# Altium project UmTRXv21.PRJPCB (part 1 of 2)
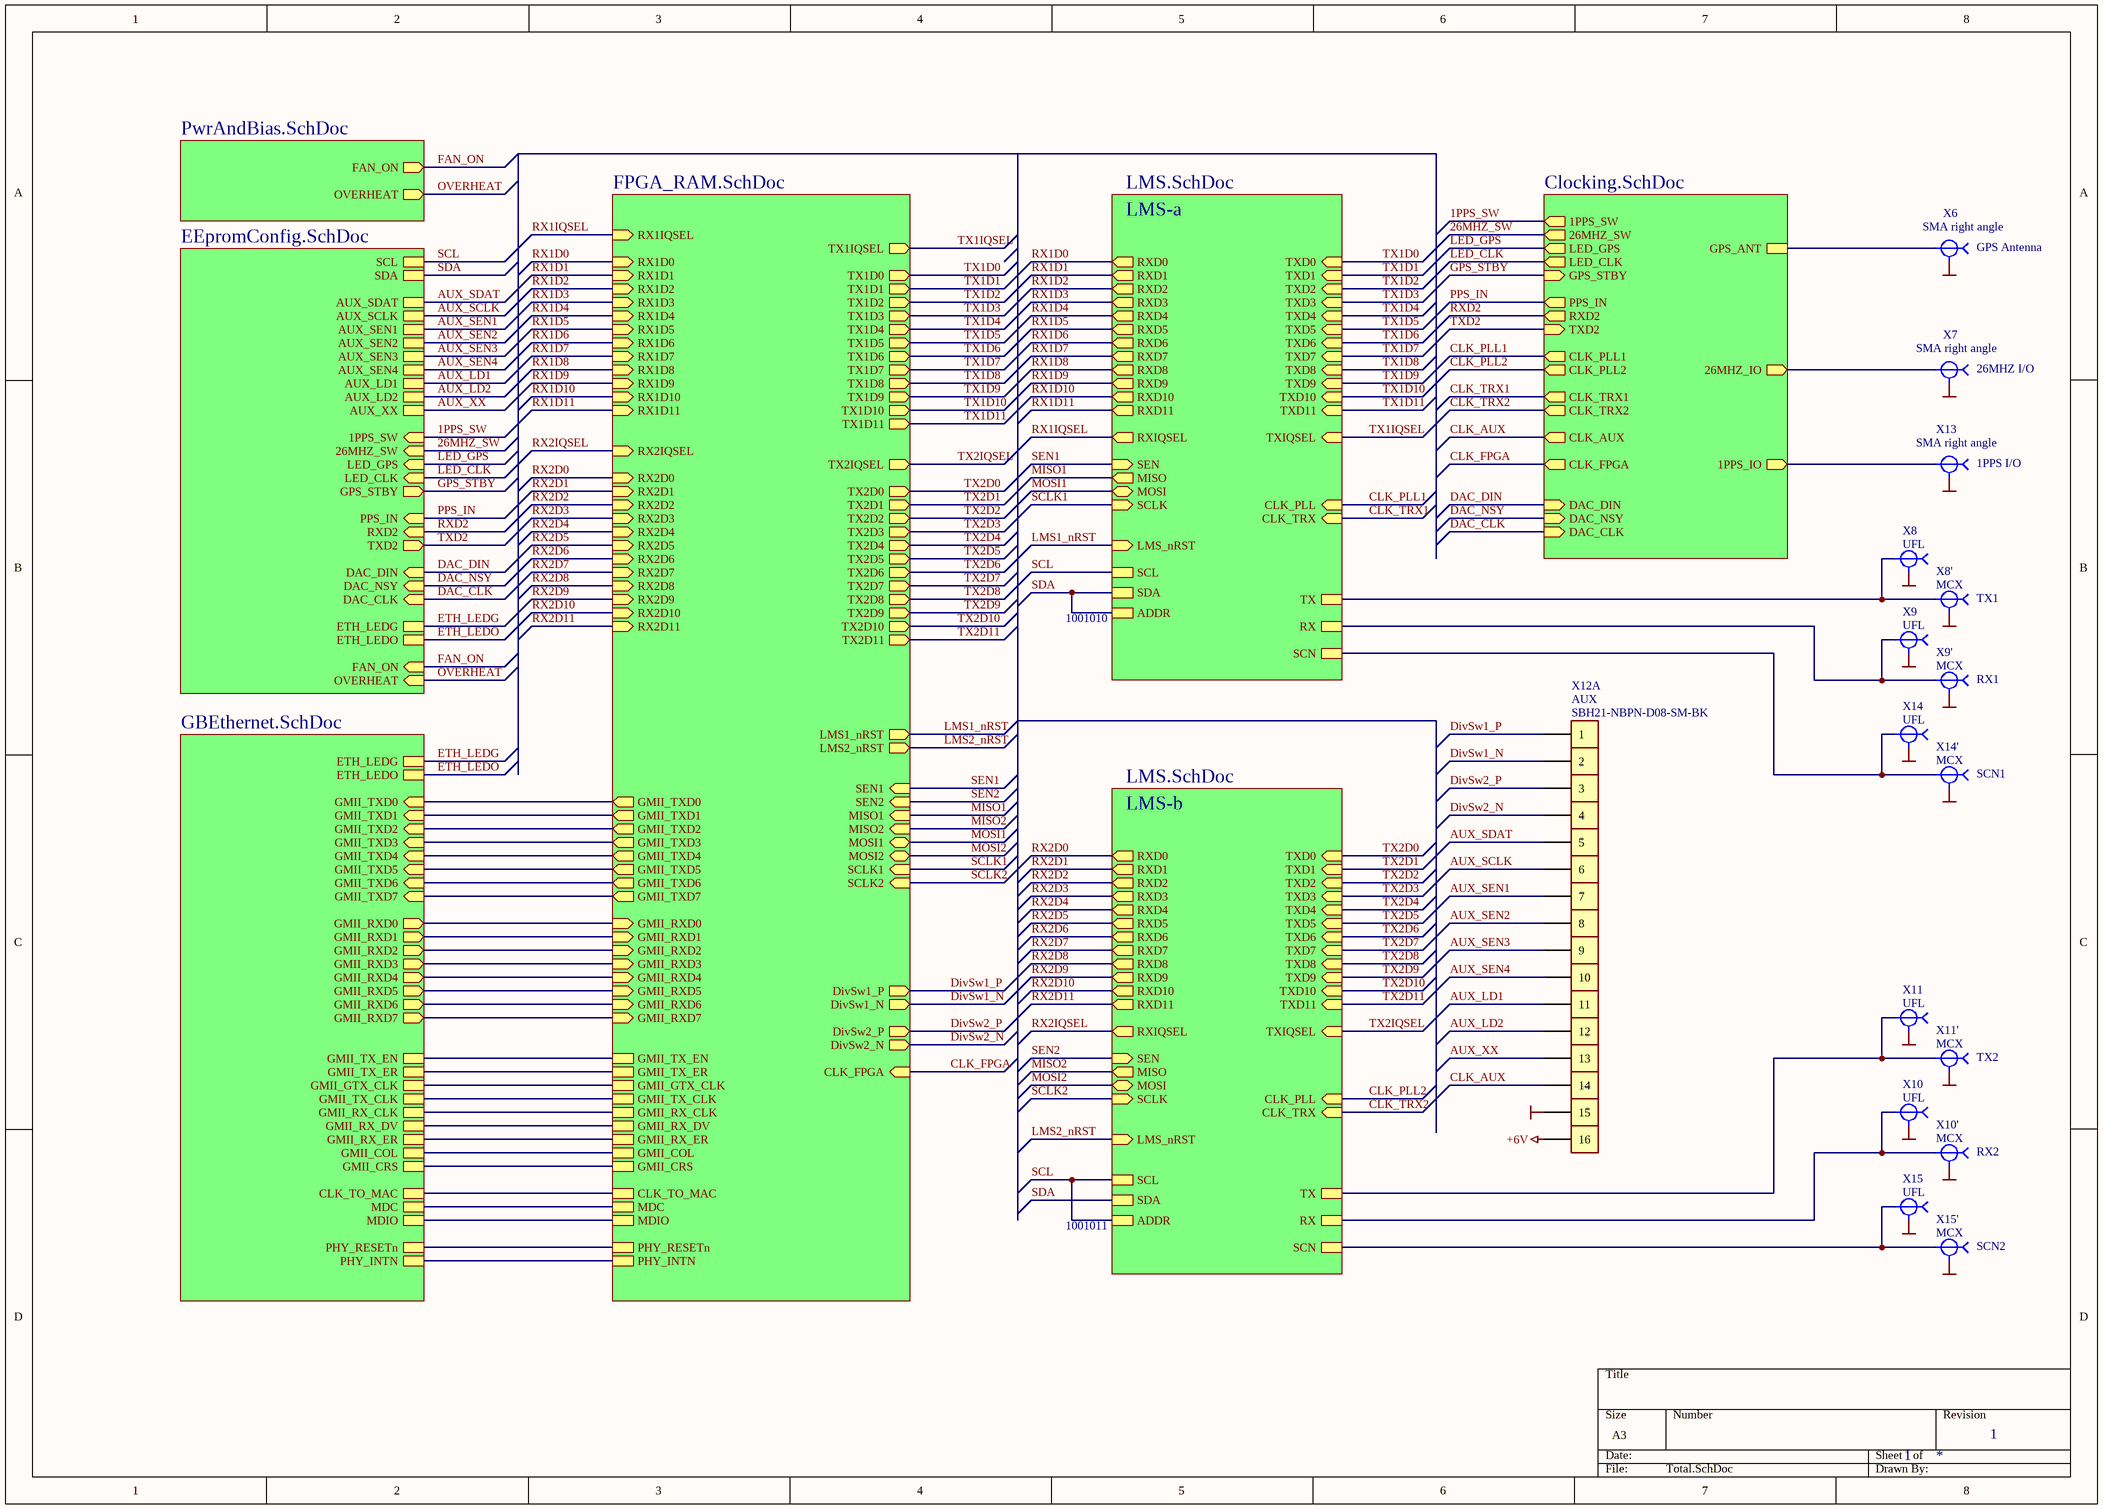
[diagram p0: Total.SchDoc]
5 sheets, 625 parts. Net scope: hierarchical (ports join the sheet entries above them; power ports are global).
Board file: UmTRXv21.PcbDoc
Sheets:
  Total.SchDoc
    PwrAndBias = PwrAndBias.SchDoc
    GBEthernet = GBEthernet.SchDoc
    EEpromConfig = EEpromConfig.SchDoc
    LMS-a = LMS.SchDoc
    LMS-b = LMS.SchDoc

## Sheet Total.SchDoc: USRP Cellular Tranceiver
size A3; Revision: 1; SheetNumber: 1; DocumentName: Fairwaves Co.

### Parts
X6  SMA right angle  Description: GPS Antenna  [SMA right angle]
X7  SMA right angle  Description: 26MHZ I/O  [SMA right angle]
X8  UFL  [U_FL]
X8'  MCX  Discription: TX1  [ML 120]
X9  UFL  [U_FL]
X9'  MCX  Discription: RX1  [ML 120]
X10  UFL  [U_FL]
X10'  MCX  Discription: RX2  [ML 120]
X11  UFL  [U_FL]
X11'  MCX  Discription: TX2  [ML 120]
X12  SBH21-NBPN-D08-SM-BK  Misc: AUX  [SBH-16]  (parts A,B,C,D,E,F,G,H,I,J,K,L,M,N,O,P of 16)
X13  SMA right angle  Description: 1PPS I/O  [SMA right angle]
X14  UFL  [U_FL]
X14'  MCX  Discription: SCN1  [ML 120]
X15  UFL  [U_FL]
X15'  MCX  Discription: SCN2  [ML 120]

### Sub-sheets
Clocking = Clocking.SchDoc (file not in this document): TXD2 (in), 26MHZ_IO (out), CLK_FPGA (out), CLK_TRX1 (out), GPS_ANT, DAC_DIN (in), DAC_NSY (in), DAC_CLK (in), PPS_IN (out), RXD2 (out), CLK_PLL1 (out), CLK_AUX (out), 1PPS_IO (out), CLK_PLL2 (out), CLK_TRX2 (out), 1PPS_SW (out), 26MHZ_SW (out), LED_GPS (out), LED_CLK (out), GPS_STBY (in)
EEpromConfig = EEpromConfig.SchDoc: PPS_IN (in), DAC_DIN (in), DAC_NSY (in), DAC_CLK (in), TXD2 (out), RXD2 (in), ETH_LEDG, ETH_LEDO, FAN_ON (in), OVERHEAT (in), AUX_SDAT, AUX_SCLK, AUX_SEN1, AUX_LD1, AUX_XX, AUX_SEN2, AUX_LD2, 1PPS_SW (in), 26MHZ_SW (in), LED_GPS (in), LED_CLK (in), AUX_SEN3, AUX_SEN4, GPS_STBY (out), SCL, SDA
FPGA_RAM = FPGA_RAM.SchDoc (file not in this document): DivSw1_P (out), DivSw1_N (out), TX1IQSEL (out), TX2IQSEL (out), RX1IQSEL (in), RX2IQSEL (in), SEN1 (in), SEN2 (in), MISO1 (in), MOSI1 (bidir), SCLK1 (in), DivSw2_P (out), DivSw2_N (out), CLK_FPGA (in), CLK_TO_MAC, GMII_TX_EN, GMII_TX_ER, GMII_GTX_CLK, GMII_TX_CLK, GMII_RX_CLK, GMII_RX_DV, GMII_RX_ER, GMII_COL, GMII_CRS, MDIO, MDC, PHY_INTN, PHY_RESETn, MISO2 (in), MOSI2 (bidir), SCLK2 (in), LMS1_nRST (out), LMS2_nRST (out), TX1D0 (out), TX1D1 (out), TX1D2 (out), TX1D3 (out), TX1D4 (out), TX1D5 (out), TX1D6 (out), TX1D7 (out), TX1D8 (out), TX1D9 (out), TX1D10 (out), TX1D11 (out), TX2D0 (out), TX2D1 (out), TX2D2 (out), TX2D3 (out), TX2D4 (out), TX2D5 (out), TX2D6 (out), TX2D7 (out), TX2D8 (out), TX2D9 (out), TX2D10 (out), TX2D11 (out), RX1D0 (in), RX1D1 (in), RX1D2 (in), RX1D3 (in), RX1D4 (in), RX1D5 (in), RX1D6 (in), RX1D7 (in), RX1D8 (in), RX1D9 (in), RX1D10 (in), RX1D11 (in), RX2D0 (in), RX2D1 (in), RX2D2 (in), RX2D3 (in), RX2D4 (in), RX2D5 (in), RX2D6 (in), RX2D7 (in), RX2D8 (in), RX2D9 (in), RX2D10 (in), RX2D11 (in), GMII_TXD0 (out), GMII_TXD1 (out), GMII_TXD2 (out), GMII_TXD3 (out), GMII_TXD4 (out), GMII_TXD5 (out), GMII_TXD6 (out), GMII_TXD7 (out), GMII_RXD0 (in), GMII_RXD1 (in), GMII_RXD2 (in), GMII_RXD3 (in), GMII_RXD4 (in), GMII_RXD5 (in), GMII_RXD6 (in), GMII_RXD7 (in)
GBEthernet = GBEthernet.SchDoc: CLK_TO_MAC, GMII_TX_ER, GMII_TX_EN, GMII_GTX_CLK, GMII_RX_CLK, GMII_TX_CLK, GMII_RX_DV, GMII_RX_ER, GMII_COL, GMII_CRS, MDC, MDIO, PHY_INTN, PHY_RESETn, ETH_LEDG, GMII_TXD0 (in), GMII_TXD1 (in), GMII_TXD2 (in), GMII_TXD3 (in), GMII_TXD4 (in), GMII_TXD5 (in), GMII_TXD6 (in), GMII_TXD7 (in), GMII_RXD0 (out), GMII_RXD1 (out), GMII_RXD2 (out), GMII_RXD3 (out), GMII_RXD4 (out), GMII_RXD5 (out), GMII_RXD6 (out), GMII_RXD7 (out), ETH_LEDO
LMS-a = LMS.SchDoc: RXD0 (out), RXIQSEL (out), SEN (in), MISO (out), MOSI (bidir), SCLK (in), RXD1 (out), RXD2 (out), RXD3 (out), RXD4 (out), RXD5 (out), RXD6 (out), RXD7 (out), RXD8 (out), RXD9 (out), RXD10 (out), RXD11 (out), TXD0 (in), TXIQSEL (in), CLK_PLL (in), TXD1 (in), TXD2 (in), TXD3 (in), TXD4 (in), TXD5 (in), TXD6 (in), TXD7 (in), TXD8 (in), TXD9 (in), TXD10 (in), TXD11 (in), TX, RX, LMS_nRST (in), SCN, CLK_TRX (in), SCL, SDA, ADDR
LMS-b = LMS.SchDoc: RXD0 (out), RXIQSEL (out), SEN (in), MISO (out), MOSI (bidir), SCLK (in), RXD1 (out), RXD2 (out), RXD3 (out), RXD4 (out), RXD5 (out), RXD6 (out), RXD7 (out), RXD8 (out), RXD9 (out), RXD10 (out), RXD11 (out), TXD0 (in), TXIQSEL (in), CLK_PLL (in), TXD1 (in), TXD2 (in), TXD3 (in), TXD4 (in), TXD5 (in), TXD6 (in), TXD7 (in), TXD8 (in), TXD9 (in), TXD10 (in), TXD11 (in), TX, RX, LMS_nRST (in), CLK_TRX (in), SCN, SCL, SDA, ADDR
PwrAndBias = PwrAndBias.SchDoc: FAN_ON (out), OVERHEAT (out)

### Nets
+6V: X12.16
GND: X6.2(GND) X7.2(GND) X8.2(GND) X8'.2(GND) X9.2(GND) X9'.2(GND) X10.2(GND) X10'.2(GND) X11.2(GND) X11'.2(GND) X12.15 X13.2(GND) X14.2(GND) X14'.2(GND) X15.2(GND) X15'.2(GND)
1PPS_SW: sheet EEpromConfig/1PPS_SW, sheet Clocking/1PPS_SW
26MHZ_SW: sheet EEpromConfig/26MHZ_SW, sheet Clocking/26MHZ_SW
AUX_LD1: X12.11 ; sheet EEpromConfig/AUX_LD1
AUX_LD2: X12.12 ; sheet EEpromConfig/AUX_LD2
AUX_SCLK: X12.6 ; sheet EEpromConfig/AUX_SCLK
AUX_SDAT: X12.5 ; sheet EEpromConfig/AUX_SDAT
AUX_SEN1: X12.7 ; sheet EEpromConfig/AUX_SEN1
AUX_SEN2: X12.8 ; sheet EEpromConfig/AUX_SEN2
AUX_SEN3: X12.9 ; sheet EEpromConfig/AUX_SEN3
AUX_SEN4: X12.10 ; sheet EEpromConfig/AUX_SEN4
AUX_XX: X12.13 ; sheet EEpromConfig/AUX_XX
CLK_AUX: X12.14 ; sheet Clocking/CLK_AUX
CLK_FPGA: sheet FPGA_RAM/CLK_FPGA, sheet Clocking/CLK_FPGA
CLK_PLL1: sheet Clocking/CLK_PLL1, sheet LMS-a/CLK_PLL
CLK_PLL2: sheet Clocking/CLK_PLL2, sheet LMS-b/CLK_PLL
CLK_TO_MAC: sheet FPGA_RAM/CLK_TO_MAC, sheet GBEthernet/CLK_TO_MAC
CLK_TRX1: sheet Clocking/CLK_TRX1, sheet LMS-a/CLK_TRX
CLK_TRX2: sheet Clocking/CLK_TRX2, sheet LMS-b/CLK_TRX
DAC_CLK: sheet EEpromConfig/DAC_CLK, sheet Clocking/DAC_CLK
DAC_DIN: sheet EEpromConfig/DAC_DIN, sheet Clocking/DAC_DIN
DAC_NSY: sheet EEpromConfig/DAC_NSY, sheet Clocking/DAC_NSY
DivSw1_N: X12.2 ; sheet FPGA_RAM/DivSw1_N
DivSw1_P: X12.1 ; sheet FPGA_RAM/DivSw1_P
DivSw2_N: X12.4 ; sheet FPGA_RAM/DivSw2_N
DivSw2_P: X12.3 ; sheet FPGA_RAM/DivSw2_P
ETH_LEDG: sheet GBEthernet/ETH_LEDG, sheet EEpromConfig/ETH_LEDG
ETH_LEDO: sheet GBEthernet/ETH_LEDO, sheet EEpromConfig/ETH_LEDO
FAN_ON: sheet PwrAndBias/FAN_ON, sheet EEpromConfig/FAN_ON
GMII_COL: sheet FPGA_RAM/GMII_COL, sheet GBEthernet/GMII_COL
GMII_CRS: sheet FPGA_RAM/GMII_CRS, sheet GBEthernet/GMII_CRS
GMII_GTX_CLK: sheet FPGA_RAM/GMII_GTX_CLK, sheet GBEthernet/GMII_GTX_CLK
GMII_RX_CLK: sheet FPGA_RAM/GMII_RX_CLK, sheet GBEthernet/GMII_RX_CLK
GMII_RX_DV: sheet FPGA_RAM/GMII_RX_DV, sheet GBEthernet/GMII_RX_DV
GMII_RX_ER: sheet FPGA_RAM/GMII_RX_ER, sheet GBEthernet/GMII_RX_ER
GMII_RXD0: sheet FPGA_RAM/GMII_RXD0, sheet GBEthernet/GMII_RXD0
GMII_RXD1: sheet FPGA_RAM/GMII_RXD1, sheet GBEthernet/GMII_RXD1
GMII_RXD2: sheet FPGA_RAM/GMII_RXD2, sheet GBEthernet/GMII_RXD2
GMII_RXD3: sheet FPGA_RAM/GMII_RXD3, sheet GBEthernet/GMII_RXD3
GMII_RXD4: sheet FPGA_RAM/GMII_RXD4, sheet GBEthernet/GMII_RXD4
GMII_RXD5: sheet FPGA_RAM/GMII_RXD5, sheet GBEthernet/GMII_RXD5
GMII_RXD6: sheet FPGA_RAM/GMII_RXD6, sheet GBEthernet/GMII_RXD6
GMII_RXD7: sheet FPGA_RAM/GMII_RXD7, sheet GBEthernet/GMII_RXD7
GMII_TX_CLK: sheet FPGA_RAM/GMII_TX_CLK, sheet GBEthernet/GMII_TX_CLK
GMII_TX_EN: sheet FPGA_RAM/GMII_TX_EN, sheet GBEthernet/GMII_TX_EN
GMII_TX_ER: sheet FPGA_RAM/GMII_TX_ER, sheet GBEthernet/GMII_TX_ER
GMII_TXD0: sheet FPGA_RAM/GMII_TXD0, sheet GBEthernet/GMII_TXD0
GMII_TXD1: sheet FPGA_RAM/GMII_TXD1, sheet GBEthernet/GMII_TXD1
GMII_TXD2: sheet FPGA_RAM/GMII_TXD2, sheet GBEthernet/GMII_TXD2
GMII_TXD3: sheet FPGA_RAM/GMII_TXD3, sheet GBEthernet/GMII_TXD3
GMII_TXD4: sheet FPGA_RAM/GMII_TXD4, sheet GBEthernet/GMII_TXD4
GMII_TXD5: sheet FPGA_RAM/GMII_TXD5, sheet GBEthernet/GMII_TXD5
GMII_TXD6: sheet FPGA_RAM/GMII_TXD6, sheet GBEthernet/GMII_TXD6
GMII_TXD7: sheet FPGA_RAM/GMII_TXD7, sheet GBEthernet/GMII_TXD7
GPS_STBY: sheet EEpromConfig/GPS_STBY, sheet Clocking/GPS_STBY
LED_CLK: sheet EEpromConfig/LED_CLK, sheet Clocking/LED_CLK
LED_GPS: sheet EEpromConfig/LED_GPS, sheet Clocking/LED_GPS
LMS1_nRST: sheet FPGA_RAM/LMS1_nRST, sheet LMS-a/LMS_nRST
LMS2_nRST: sheet FPGA_RAM/LMS2_nRST, sheet LMS-b/LMS_nRST
MDC: sheet FPGA_RAM/MDC, sheet GBEthernet/MDC
MDIO: sheet FPGA_RAM/MDIO, sheet GBEthernet/MDIO
MISO1: sheet FPGA_RAM/MISO1, sheet LMS-a/MISO
MISO2: sheet FPGA_RAM/MISO2, sheet LMS-b/MISO
MOSI1: sheet FPGA_RAM/MOSI1, sheet LMS-a/MOSI
MOSI2: sheet FPGA_RAM/MOSI2, sheet LMS-b/MOSI
OVERHEAT: sheet PwrAndBias/OVERHEAT, sheet EEpromConfig/OVERHEAT
PHY_INTN: sheet FPGA_RAM/PHY_INTN, sheet GBEthernet/PHY_INTN
PHY_RESETn: sheet FPGA_RAM/PHY_RESETn, sheet GBEthernet/PHY_RESETn
PPS_IN: sheet EEpromConfig/PPS_IN, sheet Clocking/PPS_IN
RX: X9.1 X9'.1 ; sheet LMS-a/RX
RX: X10.1 X10'.1 ; sheet LMS-b/RX  [a separate net that carries the same name]
RX1D0: sheet FPGA_RAM/RX1D0, sheet LMS-a/RXD0
RX1D1: sheet FPGA_RAM/RX1D1, sheet LMS-a/RXD1
RX1D2: sheet FPGA_RAM/RX1D2, sheet LMS-a/RXD2
RX1D3: sheet FPGA_RAM/RX1D3, sheet LMS-a/RXD3
RX1D4: sheet FPGA_RAM/RX1D4, sheet LMS-a/RXD4
RX1D5: sheet FPGA_RAM/RX1D5, sheet LMS-a/RXD5
RX1D6: sheet FPGA_RAM/RX1D6, sheet LMS-a/RXD6
RX1D7: sheet FPGA_RAM/RX1D7, sheet LMS-a/RXD7
RX1D8: sheet FPGA_RAM/RX1D8, sheet LMS-a/RXD8
RX1D9: sheet FPGA_RAM/RX1D9, sheet LMS-a/RXD9
RX1D10: sheet FPGA_RAM/RX1D10, sheet LMS-a/RXD10
RX1D11: sheet FPGA_RAM/RX1D11, sheet LMS-a/RXD11
RX1IQSEL: sheet FPGA_RAM/RX1IQSEL, sheet LMS-a/RXIQSEL
RX2D0: sheet FPGA_RAM/RX2D0, sheet LMS-b/RXD0
RX2D1: sheet FPGA_RAM/RX2D1, sheet LMS-b/RXD1
RX2D2: sheet FPGA_RAM/RX2D2, sheet LMS-b/RXD2
RX2D3: sheet FPGA_RAM/RX2D3, sheet LMS-b/RXD3
RX2D4: sheet FPGA_RAM/RX2D4, sheet LMS-b/RXD4
RX2D5: sheet FPGA_RAM/RX2D5, sheet LMS-b/RXD5
RX2D6: sheet FPGA_RAM/RX2D6, sheet LMS-b/RXD6
RX2D7: sheet FPGA_RAM/RX2D7, sheet LMS-b/RXD7
RX2D8: sheet FPGA_RAM/RX2D8, sheet LMS-b/RXD8
RX2D9: sheet FPGA_RAM/RX2D9, sheet LMS-b/RXD9
RX2D10: sheet FPGA_RAM/RX2D10, sheet LMS-b/RXD10
RX2D11: sheet FPGA_RAM/RX2D11, sheet LMS-b/RXD11
RX2IQSEL: sheet FPGA_RAM/RX2IQSEL, sheet LMS-b/RXIQSEL
RXD2: sheet EEpromConfig/RXD2, sheet Clocking/RXD2
SCL: sheet EEpromConfig/SCL, sheet LMS-a/SCL, sheet LMS-b/SCL, sheet LMS-b/ADDR
SCLK1: sheet FPGA_RAM/SCLK1, sheet LMS-a/SCLK
SCLK2: sheet FPGA_RAM/SCLK2, sheet LMS-b/SCLK
SCN: X14.1 X14'.1 ; sheet LMS-a/SCN
SCN: X15.1 X15'.1 ; sheet LMS-b/SCN  [a separate net that carries the same name]
SDA: sheet EEpromConfig/SDA, sheet LMS-a/SDA, sheet LMS-a/ADDR, sheet LMS-b/SDA
SEN1: sheet FPGA_RAM/SEN1, sheet LMS-a/SEN
SEN2: sheet FPGA_RAM/SEN2, sheet LMS-b/SEN
TX: X8.1 X8'.1 ; sheet LMS-a/TX
TX: X11.1 X11'.1 ; sheet LMS-b/TX  [a separate net that carries the same name]
TX1D0: sheet FPGA_RAM/TX1D0, sheet LMS-a/TXD0
TX1D1: sheet FPGA_RAM/TX1D1, sheet LMS-a/TXD1
TX1D2: sheet FPGA_RAM/TX1D2, sheet LMS-a/TXD2
TX1D3: sheet FPGA_RAM/TX1D3, sheet LMS-a/TXD3
TX1D4: sheet FPGA_RAM/TX1D4, sheet LMS-a/TXD4
TX1D5: sheet FPGA_RAM/TX1D5, sheet LMS-a/TXD5
TX1D6: sheet FPGA_RAM/TX1D6, sheet LMS-a/TXD6
TX1D7: sheet FPGA_RAM/TX1D7, sheet LMS-a/TXD7
TX1D8: sheet FPGA_RAM/TX1D8, sheet LMS-a/TXD8
TX1D9: sheet FPGA_RAM/TX1D9, sheet LMS-a/TXD9
TX1D10: sheet FPGA_RAM/TX1D10, sheet LMS-a/TXD10
TX1D11: sheet FPGA_RAM/TX1D11, sheet LMS-a/TXD11
TX1IQSEL: sheet FPGA_RAM/TX1IQSEL, sheet LMS-a/TXIQSEL
TX2D0: sheet FPGA_RAM/TX2D0, sheet LMS-b/TXD0
TX2D1: sheet FPGA_RAM/TX2D1, sheet LMS-b/TXD1
TX2D2: sheet FPGA_RAM/TX2D2, sheet LMS-b/TXD2
TX2D3: sheet FPGA_RAM/TX2D3, sheet LMS-b/TXD3
TX2D4: sheet FPGA_RAM/TX2D4, sheet LMS-b/TXD4
TX2D5: sheet FPGA_RAM/TX2D5, sheet LMS-b/TXD5
TX2D6: sheet FPGA_RAM/TX2D6, sheet LMS-b/TXD6
TX2D7: sheet FPGA_RAM/TX2D7, sheet LMS-b/TXD7
TX2D8: sheet FPGA_RAM/TX2D8, sheet LMS-b/TXD8
TX2D9: sheet FPGA_RAM/TX2D9, sheet LMS-b/TXD9
TX2D10: sheet FPGA_RAM/TX2D10, sheet LMS-b/TXD10
TX2D11: sheet FPGA_RAM/TX2D11, sheet LMS-b/TXD11
TX2IQSEL: sheet FPGA_RAM/TX2IQSEL, sheet LMS-b/TXIQSEL
TXD2: sheet EEpromConfig/TXD2, sheet Clocking/TXD2
NetX6_1: X6.1 ; sheet Clocking/GPS_ANT
NetX7_1: X7.1 ; sheet Clocking/26MHZ_IO
NetX13_1: X13.1 ; sheet Clocking/1PPS_IO

### Notes on the sheet
- 1001010
- 1001011

### Library data of the parts
X6 X7 X13 = SMA-Right Angle: Разъем; Name: SMA right angle
X8-X11 X14 X15 = U_FL: Ultraminiature Coax Connector (UMCC); Manufacturer: Tyco Electronics Corp; Dscription: GPS ANT; Name: UFL
X8' X9' X10' X11' X14' X15' = MCX SM: Manufacturer: Tyco Electronics Corp; Name: MCX
X12 = SBH21-8x2_SMD: Connector 2mm SMD; Manufacturer: Sullins; Name: SBH21-NBPN-D08-SM-BK

## Sheet PwrAndBias.SchDoc: Pwr And Biasing
size A3; Revision: 1; SheetNumber: 8
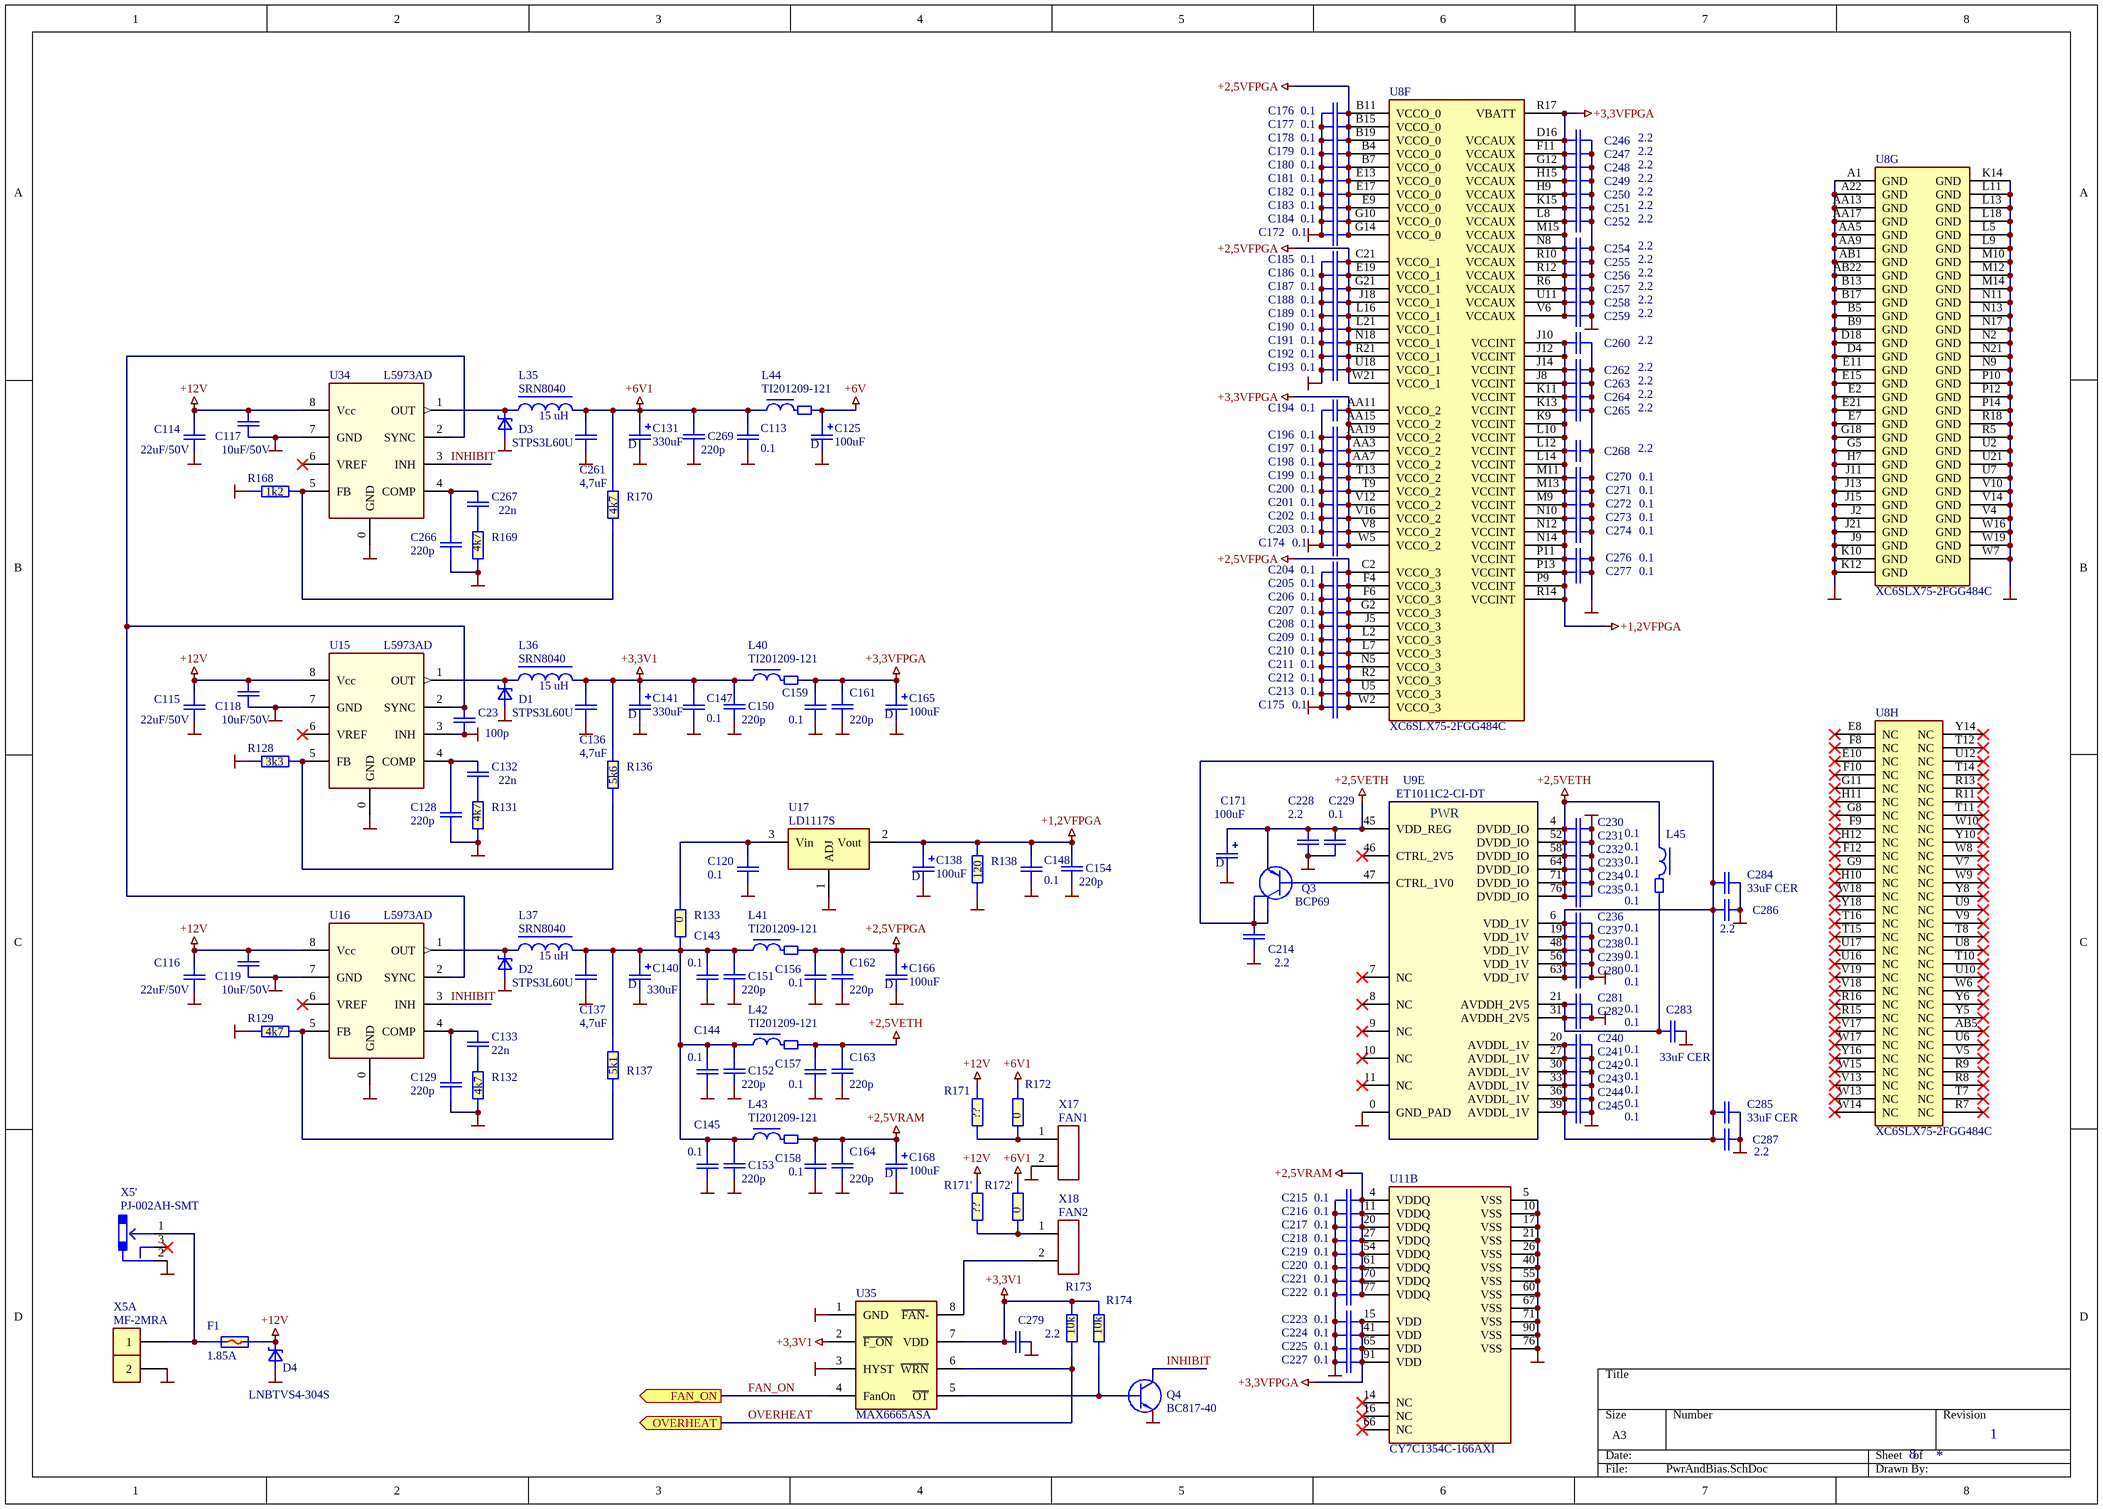
[diagram p1: PwrAndBias.SchDoc]

### Parts
C23  100p  [C0603-PHILLIPS]
C113  0.1  [C0402-Phillips]
C114  22uF/50V  [C2220]
C115  22uF/50V  [C2220]
C116  22uF/50V  [C2220]
C117  10uF/50V  [C1210_H2,5]
C118  10uF/50V  [C1210_H2,5]
C119  10uF/50V  [C1210_H2,5]
C120  0.1  [C0402-Phillips]
C125  100uF  [cd7343]
C128  220p  [C0603-PHILLIPS]
C129  220p  [C0603-PHILLIPS]
C131  330uF  [cd7343]
C132  22n  [C0603-PHILLIPS]
C133  22n  [C0603-PHILLIPS]
C136  4,7uF  [c1206]
C137  4,7uF  [c1206]
C138  100uF  [cd7343]
C140  330uF  [cd7343]
C141  330uF  [cd7343]
C143  0.1  [C0402-Phillips]
C144  0.1  [C0402-Phillips]
C145  0.1  [C0402-Phillips]
C147  0.1  [C0402-Phillips]
C148  0.1  [C0402-Phillips]
C150  220p  [C0603-PHILLIPS]
C151  220p  [C0603-PHILLIPS]
C152  220p  [C0603-PHILLIPS]
C153  220p  [C0603-PHILLIPS]
C154  220p  [C0603-PHILLIPS]
C156  0.1  [C0402-Phillips]
C157  0.1  [C0402-Phillips]
C158  0.1  [C0402-Phillips]
C159  0.1  [C0402-Phillips]
C161  220p  [C0603-PHILLIPS]
C162  220p  [C0603-PHILLIPS]
C163  220p  [C0603-PHILLIPS]
C164  220p  [C0603-PHILLIPS]
C165  100uF  [cd7343]
C166  100uF  [cd7343]
C168  100uF  [cd7343]
C171  100uF  [cd7343]
C172  0.1  [C0402-cirq]
C174  0.1  [C0402-cirq]
C175  0.1  [C0402-cirq]
C176  0.1  [C0402-cirq]
C177  0.1  [C0402-cirq]
C178  0.1  [C0402-cirq]
C179  0.1  [C0402-cirq]
C180  0.1  [C0402-cirq]
C181  0.1  [C0402-cirq]
C182  0.1  [C0402-cirq]
C183  0.1  [C0402-cirq]
C184  0.1  [C0402-cirq]
C185  0.1  [C0402-cirq]
C186  0.1  [C0402-cirq]
C187  0.1  [C0402-cirq]
C188  0.1  [C0402-cirq]
C189  0.1  [C0402-cirq]
C190  0.1  [C0402-cirq]
C191  0.1  [C0402-cirq]
C192  0.1  [C0402-cirq]
C193  0.1  [C0402-cirq]
C194  0.1  [C0402-cirq]
C196  0.1  [C0402-cirq]
C197  0.1  [C0402-cirq]
C198  0.1  [C0402-cirq]
C199  0.1  [C0402-cirq]
C200  0.1  [C0402-cirq]
C201  0.1  [C0402-cirq]
C202  0.1  [C0402-cirq]
C203  0.1  [C0402-cirq]
C204  0.1  [C0402-cirq]
C205  0.1  [C0402-cirq]
C206  0.1  [C0402-cirq]
C207  0.1  [C0402-cirq]
C208  0.1  [C0402-cirq]
C209  0.1  [C0402-cirq]
C210  0.1  [C0402-cirq]
C211  0.1  [C0402-cirq]
C212  0.1  [C0402-cirq]
C213  0.1  [C0402-cirq]
C214  2.2  [C0402-Phillips]
C215  0.1  [C0402-Phillips]
C216  0.1  [C0402-Phillips]
C217  0.1  [C0402-Phillips]
C218  0.1  [C0402-Phillips]
C219  0.1  [C0402-Phillips]
C220  0.1  [C0402-Phillips]
C221  0.1  [C0402-Phillips]
C222  0.1  [C0402-Phillips]
C223  0.1  [C0402-Phillips]
C224  0.1  [C0402-Phillips]
C225  0.1  [C0402-Phillips]
C227  0.1  [C0402-Phillips]
C228  2.2  [C0402-Phillips]
C229  0.1  [C0402-Phillips]
C230  0.1  [C0402-Phillips]
C231  0.1  [C0402-Phillips]
C232  0.1  [C0402-Phillips]
C233  0.1  [C0402-Phillips]
C234  0.1  [C0402-Phillips]
C235  0.1  [C0402-Phillips]
C236  0.1  [C0402-Phillips]
C237  0.1  [C0402-Phillips]
C238  0.1  [C0402-Phillips]
C239  0.1  [C0402-Phillips]
C240  0.1  [C0402-Phillips]
C241  0.1  [C0402-Phillips]
C242  0.1  [C0402-Phillips]
C243  0.1  [C0402-Phillips]
C244  0.1  [C0402-Phillips]
C245  0.1  [C0402-Phillips]
C246  2.2  [C0402-cirq]
C247  2.2  [C0402-cirq]
C248  2.2  [C0402-cirq]
C249  2.2  [C0402-cirq]
C250  2.2  [C0402-cirq]
C251  2.2  [C0402-cirq]
C252  2.2  [C0402-cirq]
C254  2.2  [C0402-cirq]
C255  2.2  [C0402-cirq]
C256  2.2  [C0402-cirq]
C257  2.2  [C0402-cirq]
C258  2.2  [C0402-cirq]
C259  2.2  [C0402-cirq]
C260  2.2  [C0402-cirq]
C261  4,7uF  [c1206]
C262  2.2  [C0402-cirq]
C263  2.2  [C0402-cirq]
C264  2.2  [C0402-cirq]
C265  2.2  [C0402-cirq]
C266  220p  [C0603-PHILLIPS]
C267  22n  [C0603-PHILLIPS]
C268  2.2  [C0402-cirq]
C269  220p  [C0603-PHILLIPS]
C270  0.1  [C0402-cirq]
C271  0.1  [C0402-cirq]
C272  0.1  [C0402-cirq]
C273  0.1  [C0402-cirq]
C274  0.1  [C0402-cirq]
C276  0.1  [C0402-cirq]
C277  0.1  [C0402-cirq]
C279  2.2  [C0402-Phillips]
C280  0.1  [C0402-Phillips]
C281  0.1  [C0402-Phillips]
C282  0.1  [C0402-Phillips]
C283  33uF CER  [C0805-Phillips]
C284  33uF CER  [C0805-Phillips]
C285  33uF CER  [C0805-Phillips]
C286  2.2  [C0402-Phillips]
C287  2.2  [C0402-Phillips]
D1  STPS3L60U  [SMB]
D2  STPS3L60U  [SMB]
D3  STPS3L60U  [SMB]
D4  LNBTVS4-304S  [SMC]
F1  1.85A  [FUSE2920]
L35  15 uH  [SRN8040]
L36  15 uH  [SRN8040]
L37  15 uH  [SRN8040]
L40  TI201209-121  [TI2012-Phillips]
L41  TI201209-121  [TI2012-Phillips]
L42  TI201209-121  [TI2012-Phillips]
L43  TI201209-121  [TI2012-Phillips]
L44  TI201209-121  [TI2012-Phillips]
L45  TI160808U601  [Ti160808-Phillips]  (value not drawn)
Q3  BCP69  [SOT-223]
Q4  BC817-40  [SOT23-Philips]
R128  3k3  [R0603-PHILLIPS]
R129  4k7  [R0603-PHILLIPS]
R131  4k7  [R0603-PHILLIPS]
R132  4k7  [R0603-PHILLIPS]
R133  0  [R0603-PHILLIPS]
R136  5k6  [R0603-PHILLIPS]
R137  5k1  [R0603-PHILLIPS]
R138  120  [R0603-PHILLIPS]
R168  1k2  [R0603-PHILLIPS]
R169  4k7  [R0603-PHILLIPS]
R170  4k7  [R0603-PHILLIPS]
R171  ??  [R0603-PHILLIPS]
R171'  ??  [R0603-PHILLIPS]
R172  0  [R0603-PHILLIPS]
R172'  0  [R0603-PHILLIPS]
R173  10k  [R0603-PHILLIPS]
R174  10k  [R0603-PHILLIPS]
U8  XC6SLX75-2FGG484C  [FBGA484]  (parts F,G,H of 8)
U9  ET1011C2-CI-DT  [QFN-84(10x10/0/4mm)with_pad]  (part E of 5)
U11  CY7C1354C-166AXI  [QFP-10020X14/0.65]]  (part B of 2)
U15  L5973AD  [SOIC8 - BackGND - 0.4mm dia]
U16  L5973AD  [SOIC8 - BackGND - 0.4mm dia]
U17  LD1117S  [SOT-223-1]
U34  L5973AD  [SOIC8 - BackGND - 0.4mm dia]
U35  MAX6665ASA  [SO-8]
X5  MF-2MRA  [MF-2MRA]  (parts A,B of 2)
X5'  PJ-002AH-SMT  [PJ-002AH-SMT]
X17  FAN1  [WF-2]
X18  FAN2  [WF-2]

### Ports
FAN_ON (out), OVERHEAT (out)

### Nets
+1,2VFPGA: C138.1(+) C148.1 C154.1 C260.1 C262.1 C263.1 C264.1 C265.1 C268.1 C270.1 C271.1 C272.1 C273.1 C274.1 C276.1 C277.1 R138.1 U8.J8(VCCINT) U8.J10(VCCINT) U8.J12(VCCINT) U8.J14(VCCINT) U8.K9(VCCINT) U8.K11(VCCINT) U8.K13(VCCINT) U8.L10(VCCINT) U8.L12(VCCINT) U8.L14(VCCINT) U8.M9(VCCINT) U8.M11(VCCINT) U8.M13(VCCINT) U8.N10(VCCINT) U8.N12(VCCINT) U8.N14(VCCINT) U8.P9(VCCINT) U8.P11(VCCINT) U8.P13(VCCINT) U8.R14(VCCINT) U17.2(Vout)
+2,5VETH: C157.1 C163.1 C171.1(+) C228.2 C229.1 C230.1 C231.1 C232.1 C233.1 C234.1 C235.1 L42.2 L45.1 Q3.3(E) U9.4(DVDD_IO) U9.45(VDD_REG) U9.52(DVDD_IO) U9.58(DVDD_IO) U9.64(DVDD_IO) U9.71(DVDD_IO) U9.76(DVDD_IO)
+2,5VFPGA: C156.1 C162.1 C166.1(+) C172.2 C175.2 C176.2 C177.2 C178.2 C179.2 C180.2 C181.2 C182.2 C183.2 C184.2 C185.2 C186.2 C187.2 C188.2 C189.2 C190.2 C191.2 C192.2 C193.2 C204.2 C205.2 C206.2 C207.2 C208.2 C209.2 C210.2 C211.2 C212.2 C213.2 L41.2 U8.B4(VCCO_0) U8.B7(VCCO_0) U8.B11(VCCO_0) U8.B15(VCCO_0) U8.B19(VCCO_0) U8.C2(VCCO_3) U8.C21(VCCO_1) U8.E9(VCCO_0) U8.E13(VCCO_0) U8.E17(VCCO_0) U8.E19(VCCO_1) U8.F4(VCCO_3) U8.F6(VCCO_3) U8.G2(VCCO_3) U8.G10(VCCO_0) U8.G14(VCCO_0) U8.G21(VCCO_1) U8.J5(VCCO_3) U8.J18(VCCO_1) U8.L2(VCCO_3) U8.L7(VCCO_3) U8.L16(VCCO_1) U8.L21(VCCO_1) U8.N5(VCCO_3) U8.N18(VCCO_1) U8.R2(VCCO_3) U8.R21(VCCO_1) U8.U5(VCCO_3) U8.U18(VCCO_1) U8.W2(VCCO_3) U8.W21(VCCO_1)
+2,5VRAM: C158.1 C164.1 C168.1(+) C215.2 C216.2 C217.2 C218.2 C219.2 C220.2 C221.2 C222.2 L43.2 U11.4(VDDQ) U11.11(VDDQ) U11.20(VDDQ) U11.27(VDDQ) U11.54(VDDQ) U11.61(VDDQ) U11.70(VDDQ) U11.77(VDDQ)
+3,3V1: C136.1 C141.1(+) C147.1 C150.1 C279.1 L36.2 L40.1 R136.1 R173.1 R174.1 U35.2(~{F_ON}) U35.7(VDD)
+3,3VFPGA: C159.1 C161.1 C165.1(+) C174.2 C194.2 C196.2 C197.2 C198.2 C199.2 C200.2 C201.2 C202.2 C203.2 C223.2 C224.2 C225.2 C227.2 C246.1 C247.1 C248.1 C249.1 C250.1 C251.1 C252.1 C254.1 C255.1 C256.1 C257.1 C258.1 C259.1 L40.2 U8.AA3(VCCO_2) U8.AA7(VCCO_2) U8.AA11(VCCO_2) U8.AA15(VCCO_2) U8.AA19(VCCO_2) U8.D16(VCCAUX) U8.F11(VCCAUX) U8.G12(VCCAUX) U8.H9(VCCAUX) U8.H15(VCCAUX) U8.K15(VCCAUX) U8.L8(VCCAUX) U8.M15(VCCAUX) U8.N8(VCCAUX) U8.R6(VCCAUX) U8.R10(VCCAUX) U8.R12(VCCAUX) U8.R17(VBATT) U8.T9(VCCO_2) U8.T13(VCCO_2) U8.U11(VCCAUX) U8.V6(VCCAUX) U8.V8(VCCO_2) U8.V12(VCCO_2) U8.V16(VCCO_2) U8.W5(VCCO_2) U11.15(VDD) U11.41(VDD) U11.65(VDD) U11.91(VDD)
+6V: C125.1(+) L44.2
+6V1: C113.1 C131.1(+) C261.1 C269.1 L35.2 L44.1 R170.1 R172.1 R172'.1
+12V: C114.1 C115.1 C116.1 C117.1 C118.1 C119.1 D4.2(C) F1.2 R171.1 R171'.1 U15.8(Vcc) U16.8(Vcc) U34.8(Vcc)
GND: C23.2 C113.2 C114.2 C115.2 C116.2 C117.2 C118.2 C119.2 C120.2 C125.2(-) C128.2 C129.2 C131.2(-) C136.2 C137.2 C138.2(-) C140.2(-) C141.2(-) C143.2 C144.2 C145.2 C147.2 C148.2 C150.2 C151.2 C152.2 C153.2 C154.2 C156.2 C157.2 C158.2 C159.2 C161.2 C162.2 C163.2 C164.2 C165.2(-) C166.2(-) C168.2(-) C171.2(-) C172.1 C174.1 C175.1 C176.1 C177.1 C178.1 C179.1 C180.1 C181.1 C182.1 C183.1 C184.1 C185.1 C186.1 C187.1 C188.1 C189.1 C190.1 C191.1 C192.1 C193.1 C194.1 C196.1 C197.1 C198.1 C199.1 C200.1 C201.1 C202.1 C203.1 C204.1 C205.1 C206.1 C207.1 C208.1 C209.1 C210.1 C211.1 C212.1 C213.1 C214.1 C215.1 C216.1 C217.1 C218.1 C219.1 C220.1 C221.1 C222.1 C223.1 C224.1 C225.1 C227.1 C228.1 C229.2 C230.2 C231.2 C232.2 C233.2 C234.2 C235.2 C236.2 C237.2 C238.2 C239.2 C240.2 C241.2 C242.2 C243.2 C244.2 C245.2 C246.2 C247.2 C248.2 C249.2 C250.2 C251.2 C252.2 C254.2 C255.2 C256.2 C257.2 C258.2 C259.2 C260.2 C261.2 C262.2 C263.2 C264.2 C265.2 C266.2 C268.2 C269.2 C270.2 C271.2 C272.2 C273.2 C274.2 C276.2 C277.2 C279.2 C280.2 C281.2 C282.2 C283.2 C284.2 C285.2 C286.1 C287.1 D1.2(A) D2.2(A) D3.2(A) D4.1(A) Q4.2(E) R128.1 R129.1 R131.2 R132.2 R138.2 R168.1 R169.2 U8.A1(GND) U8.A22(GND) U8.AA5(GND) U8.AA9(GND) U8.AA13(GND) U8.AA17(GND) U8.AB1(GND) U8.AB22(GND) U8.B5(GND) U8.B9(GND) U8.B13(GND) U8.B17(GND) U8.D4(GND) U8.D18(GND) U8.E2(GND) U8.E7(GND) U8.E11(GND) U8.E15(GND) U8.E21(GND) U8.G5(GND) U8.G18(GND) U8.H7(GND) U8.J2(GND) U8.J9(GND) U8.J11(GND) U8.J13(GND) U8.J15(GND) U8.J21(GND) U8.K10(GND) U8.K12(GND) U8.K14(GND) U8.L5(GND) U8.L9(GND) U8.L11(GND) U8.L13(GND) U8.L18(GND) U8.M10(GND) U8.M12(GND) U8.M14(GND) U8.N2(GND) U8.N9(GND) U8.N11(GND) U8.N13(GND) U8.N17(GND) U8.N21(GND) U8.P10(GND) U8.P12(GND) U8.P14(GND) U8.R5(GND) U8.R18(GND) U8.U2(GND) U8.U7(GND) U8.U21(GND) U8.V4(GND) U8.V10(GND) U8.V14(GND) U8.W7(GND) U8.W16(GND) U8.W19(GND) U9.0(GND_PAD) U11.5(VSS) U11.10(VSS) U11.17(VSS) U11.21(VSS) U11.26(VSS) U11.40(VSS) U11.55(VSS) U11.60(VSS) U11.67(VSS) U11.71(VSS) U11.76(VSS) U11.90(VSS) U15.0(GND) U15.3(INH) U15.7(GND) U16.0(GND) U16.7(GND) U17.1(ADJ) U34.0(GND) U34.7(GND) U35.1(GND) U35.3(HYST) X5.2 X5'.2 X17.2
FAN_ON: U35.4(FanOn) ; port FAN_ON
INHIBIT: Q4.3(C) U16.3(INH) U34.3(INH)
OVERHEAT: R173.2 U35.6(~{WRN}) ; port OVERHEAT
NetC23_1: C23.1 U15.2(SYNC) U16.2(SYNC) U34.2(SYNC)
NetC120_1: C120.1 R133.2 U17.3(Vin)
NetC128_1: C128.1 C132.1 U15.4(COMP)
NetC129_1: C129.1 C133.1 U16.4(COMP)
NetC132_2: C132.2 R131.1
NetC133_2: C133.2 R132.1
NetC137_1: C137.1 C140.1(+) C143.1 C144.1 C145.1 C151.1 C152.1 C153.1 L37.2 L41.1 L42.1 L43.1 R133.1 R137.1
NetC214_2: C214.2 C236.1 C237.1 C238.1 C239.1 C240.1 C241.1 C242.1 C243.1 C244.1 C245.1 C280.1 C284.1 C285.1 C286.2 C287.2 Q3.2(C) Q3.4(C) U9.6(VDD_1V) U9.19(VDD_1V) U9.20(AVDDL_1V) U9.27(AVDDL_1V) U9.30(AVDDL_1V) U9.33(AVDDL_1V) U9.36(AVDDL_1V) U9.39(AVDDL_1V) U9.48(VDD_1V) U9.56(VDD_1V) U9.63(VDD_1V)
NetC266_1: C266.1 C267.1 U34.4(COMP)
NetC267_2: C267.2 R169.1
NetC281_1: C281.1 C282.1 C283.1 L45.2 U9.21(AVDDH_2V5) U9.31(AVDDH_2V5)
NetD1_1: D1.1(C) L36.1 U15.1(OUT)
NetD2_1: D2.1(C) L37.1 U16.1(OUT)
NetD3_1: D3.1(C) L35.1 U34.1(OUT)
NetF1_1: F1.1 X5.1 X5'.1
NetQ3_1: Q3.1(B) U9.47(CTRL_1V0)
NetQ4_1: Q4.1(B) R174.2 U35.5(~{OT})
NetR128_2: R128.2 R136.2 U15.5(FB)
NetR129_2: R129.2 R137.2 U16.5(FB)
NetR168_2: R168.2 R170.2 U34.5(FB)
NetR171'_2: R171'.2 R172'.2 X18.1
NetR171_2: R171.2 R172.2 X17.1
NetU35_8: U35.8(~{FAN}-) X18.2

Not connected (* = marked no-connect by the designer): U8 AB5(NC)* E8(NC)* E10(NC)* F8(NC)* F9(NC)* F10(NC)* F12(NC)* G8(NC)* G9(NC)* G11(NC)* H10(NC)* H11(NC)* H12(NC)* R7(NC)* R8(NC)* R9(NC)* R11(NC)* R13(NC)* R15(NC)* R16(NC)* T7(NC)* T8(NC)* T10(NC)* T11(NC)* T12(NC)* T14(NC)* T15(NC)* T16(NC)* U6(NC)* U8(NC)* U9(NC)* U10(NC)* U12(NC)* U16(NC)* U17(NC)* V5(NC)* V7(NC)* V9(NC)* V13(NC)* V17(NC)* V18(NC)* V19(NC)* W6(NC)* W8(NC)* W9(NC)* W10(NC)* W13(NC)* W14(NC)* W15(NC)* W17(NC)* W18(NC)* Y5(NC)* Y6(NC)* Y8(NC)* Y10(NC)* Y14(NC)* Y16(NC)* Y18(NC)*; U9 7(NC)* 8(NC)* 9(NC)* 10(NC)* 11(NC)* 46(CTRL_2V5)*; U11 14(NC)* 16(NC)* 66(NC)*; U15 6(VREF)*; U16 6(VREF)*; U34 6(VREF)*; X5' 3*

### Notes on the sheet
- (in symbol CD7343) D
- (in symbol ET1011C2-CI-DT, part E) PWR

### Library data of the parts
C23 C128 C129 C150-C154 C161-C164 C266 C269 = C0603: Конденсатор; Manufacturer: MURATA; Tolerance: 20%; Name: SMD0603; U/P/TKE: NP0
  C23: Value: 100p
  C128 C129 C150-C154 C161-C164 C266 C269: Value: 220p
C113 C120 C143-C145 C147 C148 C156-C159 C172 C174-C194 C196-C225 C227-C252 C254-C260 C262-C265 C268 C270-C274 C276 C277 C279-C282 C286 C287 = C0402: Конденсатор; Manufacturer: MURATA; Tolerance: 20%; Name: SMD0402; U/P/TKE: Y5V
  C113 C120 C143-C145 C147 C148 C156-C159 C172 C174-C194 C196-C213 C215-C225 C227 C229-C245 C270-C274 C276 C277 C280-C282: Value: 0.1
  C214 C228 C246-C252 C254-C260 C262-C265 C268 C279 C286 C287: Value: 2.2
C114-C116 = C2220: Конденсатор; Manufacturer: TDK; Name: C5750Y5V1H226Z; U/P/TKE: Y5V; Value: 22uF/50V
C117-C119 = C1210_H2,5: Конденсатор; Manufacturer: TAIYO YUDEN; Tolerance: 20%; Name: UMK325 BJ106MM; U/P/TKE: X5R; Value: 10uF/50V
C125 C138 C165 C166 C168 C171 = CD7343: Конденсатор; Manufacturer: SPRAGUE; Name: CASE-D; U/P/TKE: 16V; Value: 100uF
C131 C140 C141 = CD7343: Конденсатор; Manufacturer: Kemet; Name: CASE-D; U/P/TKE: 10V; Value: 330uF
C132 C133 C267 = C0603: Конденсатор; Manufacturer: MURATA; Tolerance: 20%; Name: SMD0603; U/P/TKE: X7R; Value: 22n
C136 C137 C261 = C1206: Конденсатор; Manufacturer: Taiyo Yuden; Tolerance: 10%; Name: UMK316AB7475KL-T; U/P/TKE: Y5V 50V; Value: 4,7uF
C283-C285 = C0805: Конденсатор; Manufacturer: MURATA; Tolerance: 20%; Name: SMD0805; U/P/TKE: Y5R; Value: 33uF CER
D1-D3 = B3x0B: Диод Шоттки; Manufacturer: ST; Name: STPS3L60U
D4 = STPS3L40S: Диод; Manufacturer: ST; Misc: TVS 30V 2.5kW; Name: LNBTVS4-304S
F1 = FUSE_PTC: FUSE PTC resetable; Manufacturer: Bel Fuse; Name: 0ZCD0185FF2C; U/P/TKE: 33V; Value: 1.85A
L35-L37 = L-SRN8040: Индуктивность; Manufacturer: BOURNS; Name: SRN8040; Value: 15 uH
L40-L44 = TI2012_1: Дроссель ЭМС; Manufacturer: MURATA; Name: TI201209-121; Value: *
L45 = TI160808: Дроссель ЭМС; Manufacturer: MURATA; Name: TI160808U601; Value: *
Q3 = BCP69: Транзистор; Manufacturer: INFINEON; Name: BCP69
Q4 = BC 817: Транзистор; Manufacturer: Philips; Name: BC817-40
R128 R129 R131-R133 R136-R138 R168-R171 R171' R172 R172' R173 R174 = R0603: Резистор; Manufacturer: YAGEO; Tolerance: 5%; Name: SMD0603; U/P/TKE: 0.1W
  R128: Value: 3k3
  R129 R131 R132 R169 R170: Value: 4k7
  R133 R172 R172': Value: 0
  R136: Value: 5k6
  R137: Value: 5k1
  R138: Value: 120
  R168: Value: 1k2
  R171 R171': Value: ??
  R173 R174: Value: 10k
U8 = XC6SLX75-2FGG484C: Spartan-6 LX 1.2V FPGA, 270 User I/Os, 484-Ball Fine-Pitch BGA (1.0mm Pitch), Speed Grade 2, Commercial Grade, Pb-Free; Manufacturer: Xilinx; Published: 1-Jul-2010; Supplier 1: Digi-Key; Supplier Part Number 1: XC6SLX75-2FGG484C-ND; ComponentLink1Description: Manufacturer Link; ComponentLink1URL: http://www.xilinx.com; ComponentLink2Description: Spartan-6 Datasheet; ComponentLink2URL: http://www.xilinx.com/support/documentation/data_sheets/ds160.pdf; ComponentLink3Description: Spartan-6 Documents; ComponentLink3URL: http://www.xilinx.com/support/documentation/spartan-6.htm; ComponentLink4Description: Xilinx.com Home; ComponentLink4URL: http://www.xilinx.com; Misc: Spartan-6 LX 1.2V FPGA; Name: XC6SLX75-2FGG484C
U9 = ET1011C2-CI-DT: Микросхема; Manufacturer: LSI; PDF: d:\Proj\Components\LSI\Si5330.pdf; Misc: Gigabit Ethernet Transceiver; Name: ET1011C2-CI-DT
U11 = CY7C1354C-166AXI: Микросхема; Manufacturer: Cypress; Misc: Pipelined SRAM with NoBL™ Architecture; PDF: d:\Proj\Components\Cypress\CY7C1354C_CY7C1356C2.pdf; Name: CY7C1354C-166AXI
U15 U16 U34 = L5973D: Микросхема; Manufacturer: ST; Misc: step down switching regulator; Swap: No; PDF: d:\Proj\Components\ST\L5973D(stepdown2,5A)_ST.pdf; Name: L5973AD
U17 = LD1117ADJ: Микросхема; Manufacturer: STMicro; Swap: No; Name: LD1117S
U35 = MAX6665ASA: Микросхема; Manufacturer: Maxim; Swap: No; PDF: d:\Proj\Components\Maxim\MAX6665.pdf; Misc: Fan Controller/Driver; Name: MAX6665ASA
X5 = MF-2MRA: Разъем; Manufacturer: BM; Name: MF-2MRA
X5' = PJ-002AH-SMT: Connector; Manufacturer: CUI; Name: PJ-002AH-SMT; Type: Barrel Power
X17 X18 = WF-2: Разъем; Manufacturer: BM
  X17: Name: FAN1
  X18: Name: FAN2

## Sheet GBEthernet.SchDoc: BaseBand Front-End
size A3; Revision: 1; SheetNumber: 6
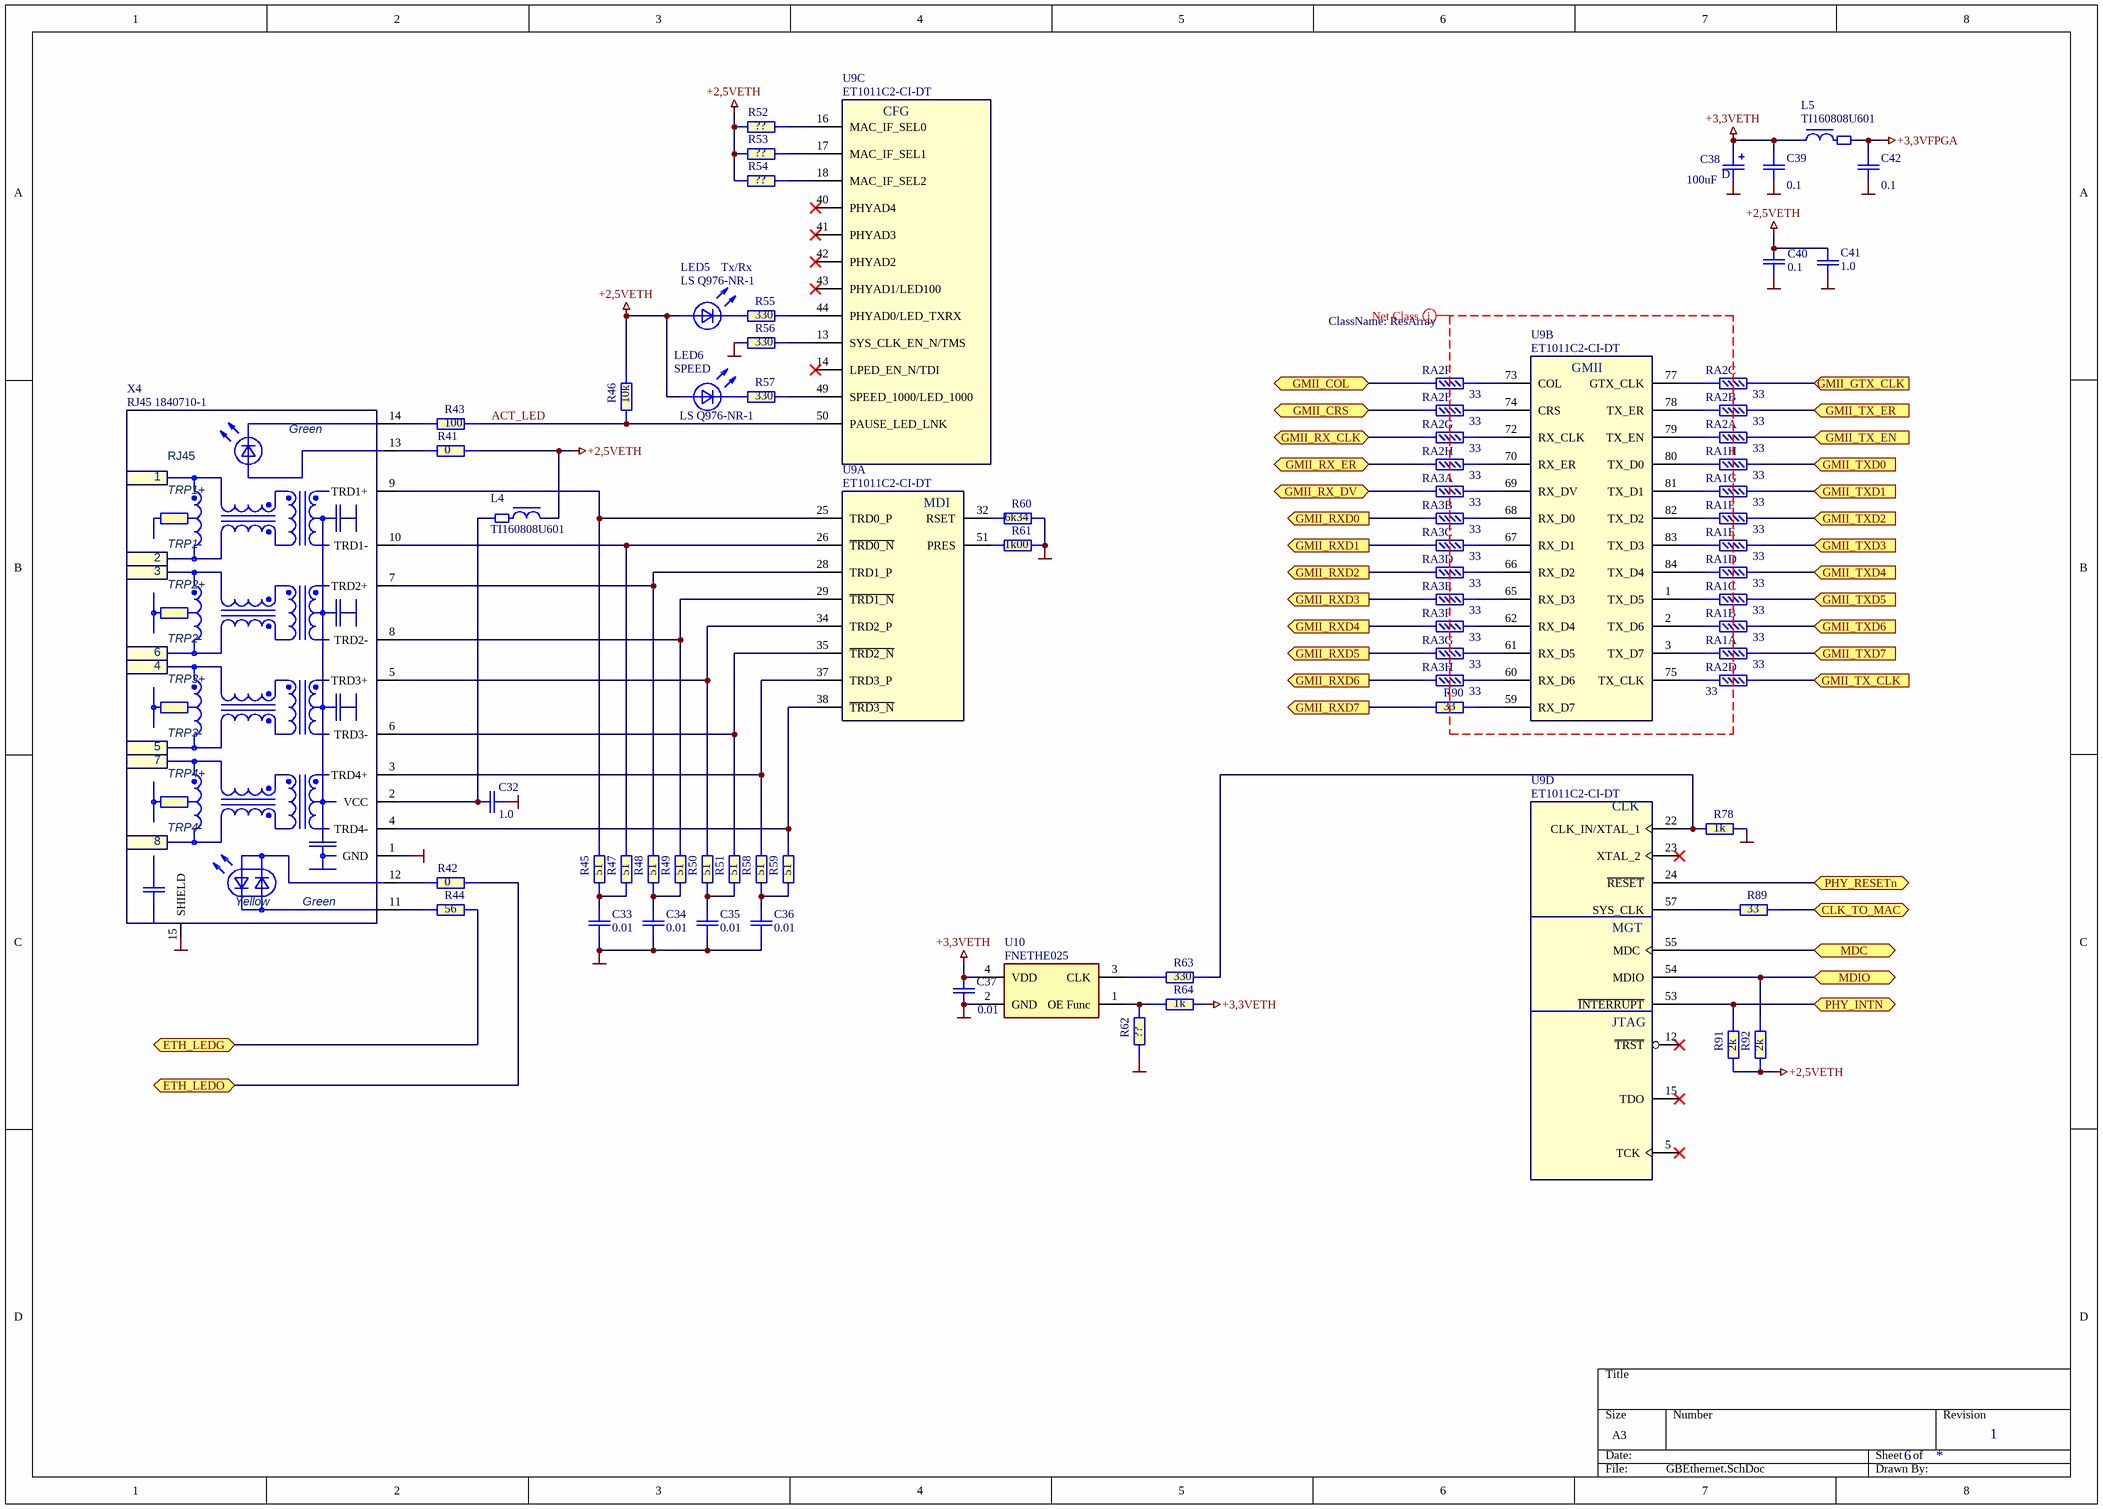
[diagram p2: GBEthernet.SchDoc]

### Parts
C32  1.0  [C0603-PHILLIPS]
C33  0.01  [C0402-Phillips]
C34  0.01  [C0402-Phillips]
C35  0.01  [C0402-Phillips]
C36  0.01  [C0402-Phillips]
C37  0.01  [C0402-Phillips]
C38  100uF  [cd7343]
C39  0.1  [C0402-Phillips]
C40  0.1  [C0402-Phillips]
C41  1.0  [C0603-PHILLIPS]
C42  0.1  [C0402-Phillips]
L4  TI160808U601  [Ti160808-Phillips]
L5  TI160808U601  [Ti160808-Phillips]
LED5  LS Q976-NR-1  Misc: Tx/Rx  [LED-0603y]
LED6  LS Q976-NR-1  Misc: SPEED  [LED-0603y]
R41  0  [R0603-PHILLIPS]
R42  0  [R0603-PHILLIPS]
R43  100  [R0603-PHILLIPS]
R44  56  [R0603-PHILLIPS]
R45  51  [R0603-PHILLIPS]
R46  10k  [R0603-PHILLIPS]
R47  51  [R0603-PHILLIPS]
R48  51  [R0603-PHILLIPS]
R49  51  [R0603-PHILLIPS]
R50  51  [R0603-PHILLIPS]
R51  51  [R0603-PHILLIPS]
R52  ??  [R0603-PHILLIPS]
R53  ??  [R0603-PHILLIPS]
R54  ??  [R0603-PHILLIPS]
R55  330  [R0603-PHILLIPS]
R56  330  [R0603-PHILLIPS]
R57  330  [R0603-PHILLIPS]
R58  51  [R0603-PHILLIPS]
R59  51  [R0603-PHILLIPS]
R60  6k34  [R0603-PHILLIPS]
R61  1k00  [R0603-PHILLIPS]
R62  ??  [R0603-PHILLIPS]
R63  330  [R0603-PHILLIPS]
R64  1k  [R0603-PHILLIPS]
R78  1k  [R0603-PHILLIPS]
R89  33  [R0603-PHILLIPS]
R90  33  [R0603-PHILLIPS]
R91  2k  [R0603-PHILLIPS]
R92  2k  [R0603-PHILLIPS]
RA1  33  [YC248]  (parts A,B,C,D,E,F,G,H of 8)
RA2  33  [YC248]  (parts A,B,C,D,E,F,G,H of 8)
RA3  33  [YC248]  (parts A,B,C,D,E,F,G,H of 8)
U9  ET1011C2-CI-DT  [QFN-84(10x10/0/4mm)with_pad]  (parts A,B,C,D of 5)
U10  FNETHE025  [7x5mm]
X4  RJ45 1840710-1  [RJ45 1840710-x]

### Ports
CLK_TO_MAC, ETH_LEDG, ETH_LEDO, GMII_COL, GMII_CRS, GMII_GTX_CLK (in), GMII_RX_CLK, GMII_RX_DV, GMII_RX_ER, GMII_RXD0 (out), GMII_RXD1 (out), GMII_RXD2 (out), GMII_RXD3 (out), GMII_RXD4 (out), GMII_RXD5 (out), GMII_RXD6 (out), GMII_RXD7 (out), GMII_TX_CLK (in), GMII_TX_EN (in), GMII_TX_ER (in), GMII_TXD0 (in), GMII_TXD1 (in), GMII_TXD2 (in), GMII_TXD3 (in), GMII_TXD4 (in), GMII_TXD5 (in), GMII_TXD6 (in), GMII_TXD7 (in), MDC, MDIO, PHY_INTN, PHY_RESETn

### Nets
+2,5VETH: C40.1 C41.2 L4.1 LED5.2(A) LED6.2(A) R41.2 R46.2 R52.1 R53.1 R54.1 R91.1 R92.1
+3,3VETH: C37.1 C38.1(+) C39.1 L5.1 R64.2 U10.4(VDD)
+3,3VFPGA: C42.1 L5.2
GND: C32.1 C33.2 C34.2 C35.2 C36.2 C37.2 C38.2(-) C39.2 C40.2 C41.1 C42.2 R56.1 R60.2 R61.2 R62.1 R78.2 U10.2(GND) X4.1(GND) X4.15(SHIELD)
ACT_LED: R43.2 R46.1 U9.50(PAUSE_LED_LNK)
CLK_TO_MAC: R89.2 ; port CLK_TO_MAC
ETH_LEDG: R44.2 ; port ETH_LEDG
ETH_LEDO: R42.2 ; port ETH_LEDO
GMII_COL: RA2.11 ; port GMII_COL
GMII_CRS: RA2.12 ; port GMII_CRS
GMII_GTX_CLK: RA2.14 ; port GMII_GTX_CLK
GMII_RX_CLK: RA2.10 ; port GMII_RX_CLK
GMII_RX_DV: RA3.16 ; port GMII_RX_DV
GMII_RX_ER: RA2.9 ; port GMII_RX_ER
GMII_RXD0: RA3.15 ; port GMII_RXD0
GMII_RXD1: RA3.14 ; port GMII_RXD1
GMII_RXD2: RA3.13 ; port GMII_RXD2
GMII_RXD3: RA3.12 ; port GMII_RXD3
GMII_RXD4: RA3.11 ; port GMII_RXD4
GMII_RXD5: RA3.10 ; port GMII_RXD5
GMII_RXD6: RA3.9 ; port GMII_RXD6
GMII_RXD7: R90.1 ; port GMII_RXD7
GMII_TX_CLK: RA2.13 ; port GMII_TX_CLK
GMII_TX_EN: RA2.16 ; port GMII_TX_EN
GMII_TX_ER: RA2.15 ; port GMII_TX_ER
GMII_TXD0: RA1.9 ; port GMII_TXD0
GMII_TXD1: RA1.10 ; port GMII_TXD1
GMII_TXD2: RA1.11 ; port GMII_TXD2
GMII_TXD3: RA1.12 ; port GMII_TXD3
GMII_TXD4: RA1.13 ; port GMII_TXD4
GMII_TXD5: RA1.14 ; port GMII_TXD5
GMII_TXD6: RA1.15 ; port GMII_TXD6
GMII_TXD7: RA1.16 ; port GMII_TXD7
MDC: U9.55(MDC) ; port MDC
MDIO: R92.2 U9.54(MDIO) ; port MDIO
PHY_INTN: R91.2 U9.53(~{INTERRUPT}) ; port PHY_INTN
PHY_RESETn: U9.24(~{RESET}) ; port PHY_RESETn
NetC32_2: C32.2 L4.2 X4.2(VCC)
NetC33_1: C33.1 R45.1 R47.1
NetC34_1: C34.1 R48.1 R49.1
NetC35_1: C35.1 R50.1 R51.1
NetC36_1: C36.1 R58.1 R59.1
NetLED5_1: LED5.1(K) R55.1
NetLED6_1: LED6.1(K) R57.1
NetR41_1: R41.1 X4.13(LED1+)
NetR42_1: R42.1 X4.12(LED2+Y)
NetR43_1: R43.1 X4.14(LED1-)
NetR44_1: R44.1 X4.11(LED2+G)
NetR45_2: R45.2 U9.25(TRD0_P) X4.9(TRD1+)
NetR47_2: R47.2 U9.26(~{TRD0_N}) X4.10(TRD1-)
NetR48_2: R48.2 U9.28(TRD1_P) X4.7(TRD2+)
NetR49_2: R49.2 U9.29(~{TRD1_N}) X4.8(TRD2-)
NetR50_2: R50.2 U9.34(TRD2_P) X4.5(TRD3+)
NetR51_2: R51.2 U9.35(~{TRD2_N}) X4.6(TRD3-)
NetR52_2: R52.2 U9.16(MAC_IF_SEL0)
NetR53_2: R53.2 U9.17(MAC_IF_SEL1)
NetR54_2: R54.2 U9.18(MAC_IF_SEL2)
NetR55_2: R55.2 U9.44(PHYAD0/LED_TXRX)
NetR56_2: R56.2 U9.13(SYS_CLK_EN_N/TMS)
NetR57_2: R57.2 U9.49(SPEED_1000/LED_1000)
NetR58_2: R58.2 U9.37(TRD3_P) X4.3(TRD4+)
NetR59_2: R59.2 U9.38(~{TRD3_N}) X4.4(TRD4-)
NetR60_1: R60.1 U9.32(RSET)
NetR61_1: R61.1 U9.51(PRES)
NetR62_2: R62.2 R64.1 U10.1(OE_Func)
NetR63_1: R63.1 U10.3(CLK)
NetR63_2: R63.2 R78.1 U9.22(CLK_IN/XTAL_1)
NetR89_1: R89.1 U9.57(SYS_CLK)
NetR90_2: R90.2 U9.59(RX_D7)
NetRA1_1: RA1.1 U9.3(TX_D7)
NetRA1_2: RA1.2 U9.2(TX_D6)
NetRA1_3: RA1.3 U9.1(TX_D5)
NetRA1_4: RA1.4 U9.84(TX_D4)
NetRA1_5: RA1.5 U9.83(TX_D3)
NetRA1_6: RA1.6 U9.82(TX_D2)
NetRA1_7: RA1.7 U9.81(TX_D1)
NetRA1_8: RA1.8 U9.80(TX_D0)
NetRA2_1: RA2.1 U9.79(TX_EN)
NetRA2_2: RA2.2 U9.78(TX_ER)
NetRA2_3: RA2.3 U9.77(GTX_CLK)
NetRA2_4: RA2.4 U9.75(TX_CLK)
NetRA2_5: RA2.5 U9.74(CRS)
NetRA2_6: RA2.6 U9.73(COL)
NetRA2_7: RA2.7 U9.72(RX_CLK)
NetRA2_8: RA2.8 U9.70(RX_ER)
NetRA3_1: RA3.1 U9.69(RX_DV)
NetRA3_2: RA3.2 U9.68(RX_D0)
NetRA3_3: RA3.3 U9.67(RX_D1)
NetRA3_4: RA3.4 U9.66(RX_D2)
NetRA3_5: RA3.5 U9.65(RX_D3)
NetRA3_6: RA3.6 U9.62(RX_D4)
NetRA3_7: RA3.7 U9.61(RX_D5)
NetRA3_8: RA3.8 U9.60(RX_D6)

Not connected (* = marked no-connect by the designer): U9 5(TCK)* 12(~{TRST})* 14(LPED_EN_N/TDI)* 15(TDO)* 23(XTAL_2)* 40(PHYAD4)* 41(PHYAD3)* 42(PHYAD2)* 43(PHYAD1/LED100)*

### Layout directives
net class ResArray: (no net found under the mark)

### Notes on the sheet
- (in symbol CD7343) D
- (in symbol ET1011C2-CI-DT, part A) MDI
- (in symbol ET1011C2-CI-DT, part B) GMII
- (in symbol ET1011C2-CI-DT, part C) CFG
- (in symbol ET1011C2-CI-DT, part D) CLK; MGT; JTAG
- (in symbol RJ45 1840710-5) Green; RJ45; TRP1+; TRP1-; TRP2+; TRP2-; TRP3+; TRP3-; TRP4+; TRP4-; Yellow

### Library data of the parts
C32 C41 = C0603: Конденсатор; Manufacturer: MURATA; Tolerance: 20%; Name: SMD0603; U/P/TKE: Y5V; Value: 1.0
C33-C37 C39 C40 C42 = C0402: as C113 on sheet PwrAndBias
  C33-C37: Value: 0.01
  C39 C40 C42: Value: 0.1
C38 = CD7343: Конденсатор; Manufacturer: SPRAGUE; Name: CASE-G; U/P/TKE: 16V; Value: 100uF
L4 L5 = TI160808: Дроссель ЭМС; Manufacturer: MURATA; Name: TI160808U601; Value: *
LED5 LED6 = LED0603: Светодиод; Manufacturer: OSRAM Opto Semiconductors Inc; Name: LS Q976-NR-1
R41-R59 R62-R64 R78 R89-R92 = R0603: as R128 on sheet PwrAndBias
  R41 R42: Value: 0
  R43: Value: 100
  R44: Value: 56
  R45 R47-R51 R58 R59: Value: 51
  R46: Value: 10k
  R52-R54 R62: Value: ??
  R55-R57 R63: Value: 330
  R64 R78: Value: 1k
  R89 R90: Value: 33
  R91 R92: Value: 2k
R60 R61 = R0603: Резистор; Manufacturer: YAGEO; Tolerance: 1%; Name: SMD0603; U/P/TKE: 0.1W
  R60: Value: 6k34
  R61: Value: 1k00
RA1-RA3 = YC248: Резисторная сборка; Manufacturer: Yageo; Misc: Резисторная сборка 8 шт. шаг 0.5 мм; U/P/TKE: 0.062W; Tolerance: 5%; Value: 33; Name: YC248
U9 = ET1011C2-CI-DT: as U9 on sheet PwrAndBias; Name: ET1011C2-CI-DT
U10 = FNETHE025: Генератор; Manufacturer: Saronix-eCera; Swap: No; PDF: d:\Proj\Components\Разное\FNETHE025.pdf; Misc: Low-Jitter 25MHz Gbe XO; Name: FNETHE025
X4 = RJ45 1840710-5: Модуль разъёма RJ45; Manufacturer: Tyco Electronics AMP; Name: RJ45 1840710-1

## Sheet EEpromConfig.SchDoc: BaseBand Front-End
size A3; Revision: 1; SheetNumber: 7
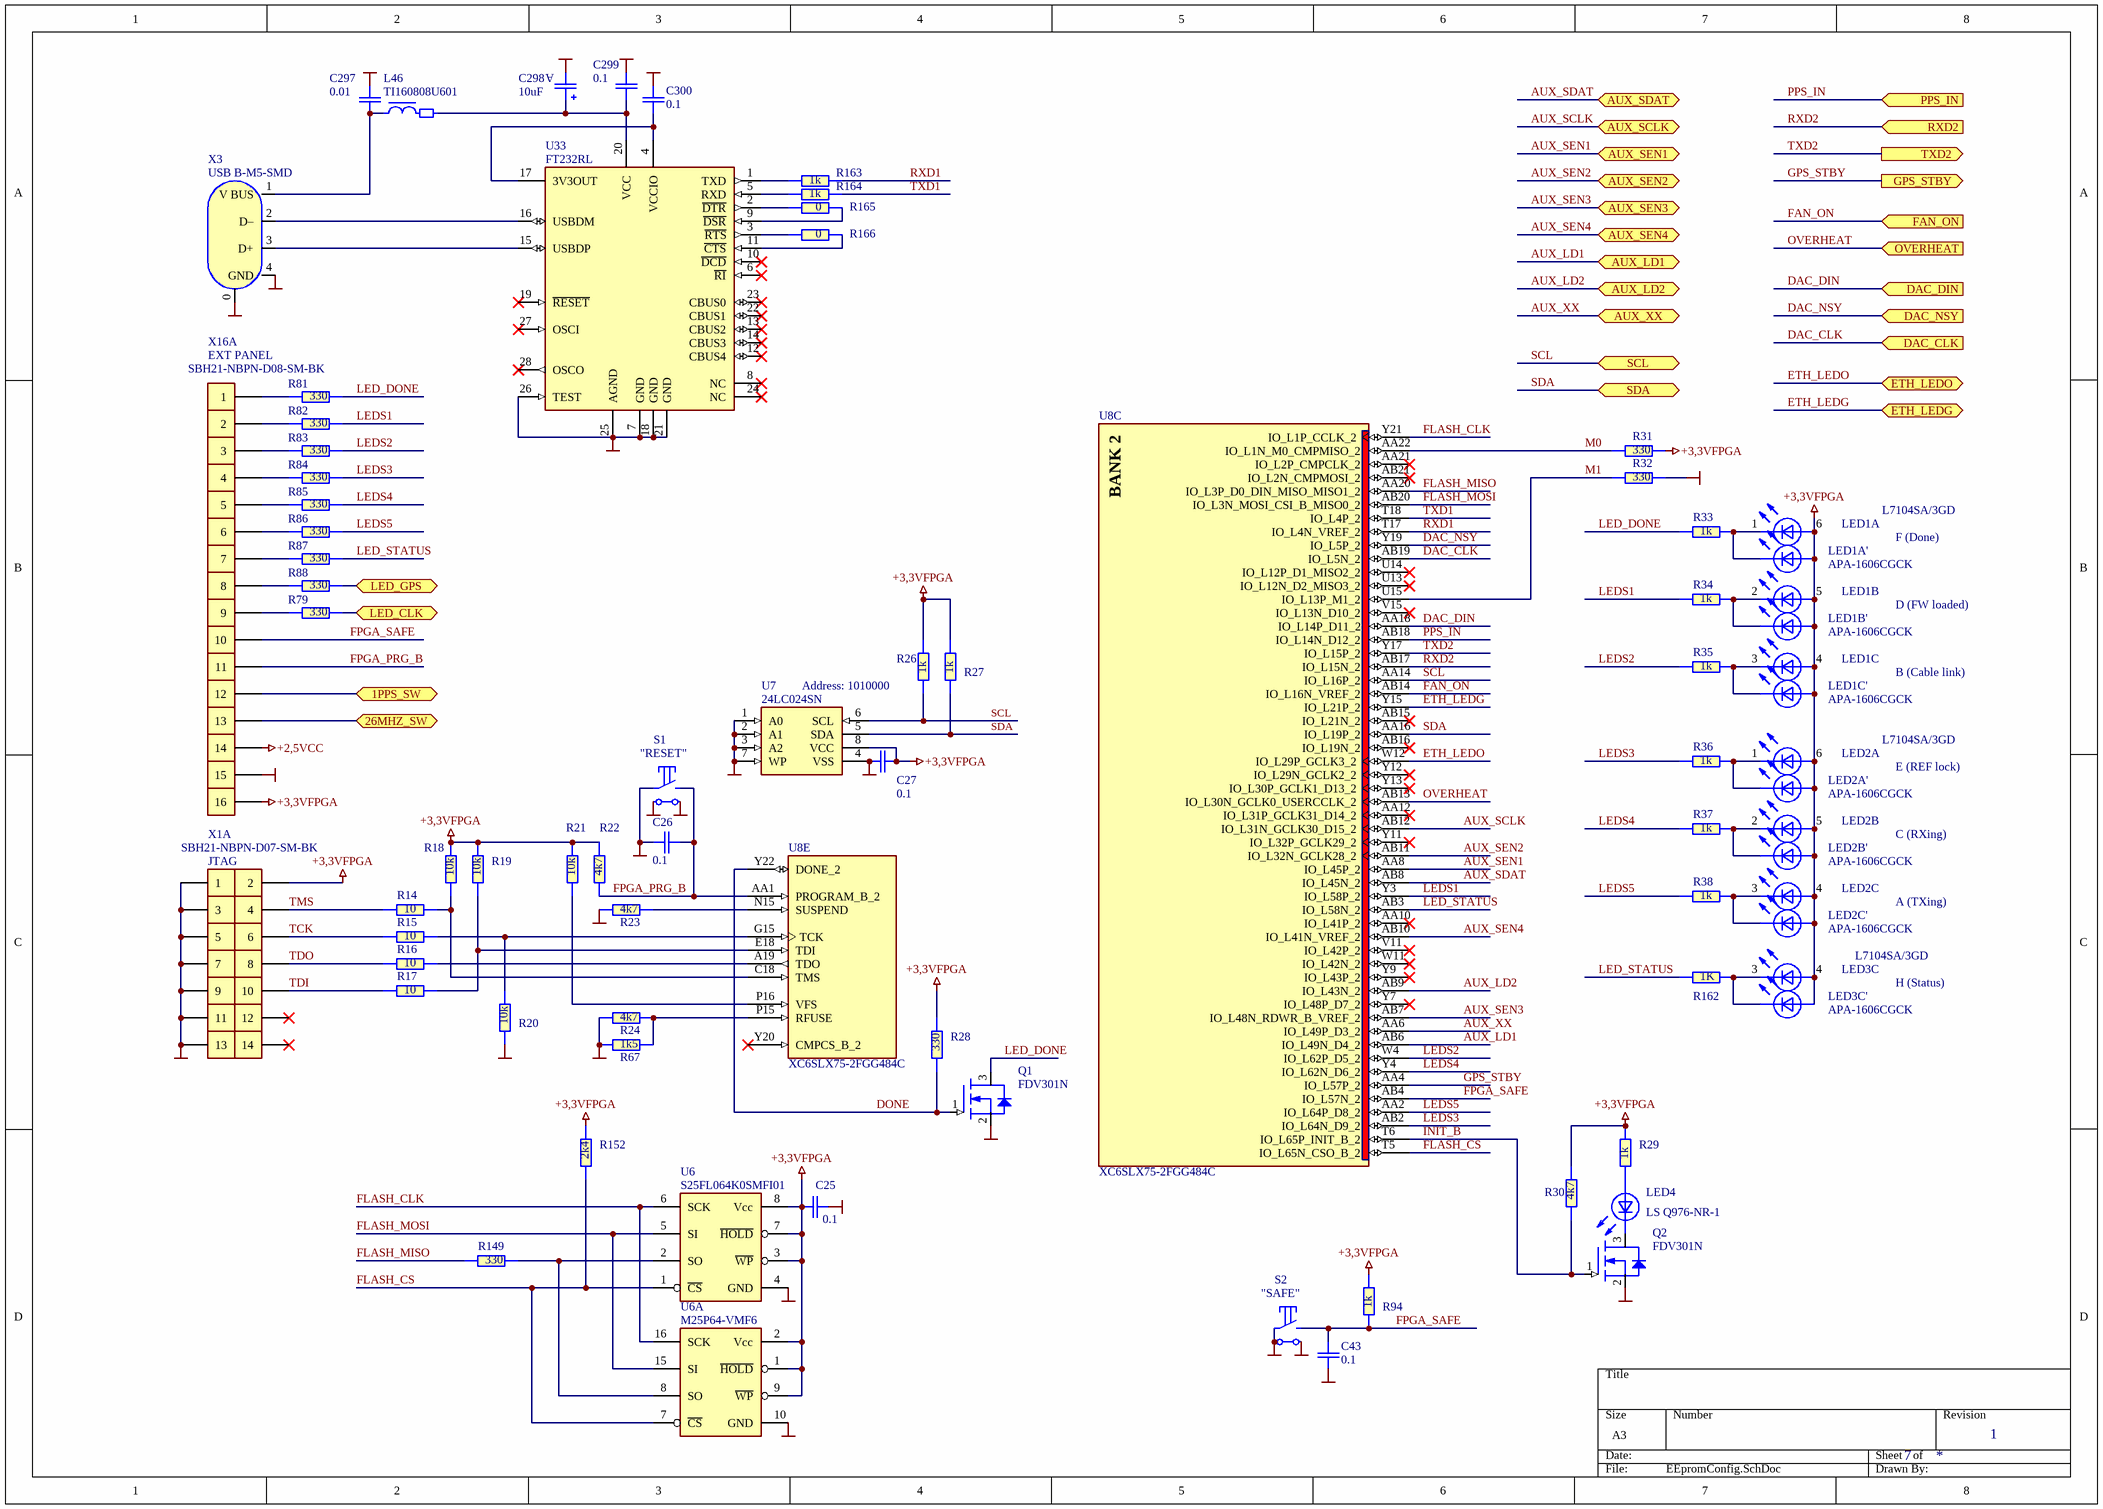
[diagram p3: EEpromConfig.SchDoc]

### Parts
C25  0.1  [C0402-Phillips]
C26  0.1  [C0402-Phillips]
C27  0.1  [C0402-Phillips]
C43  0.1  [C0402-Phillips]
C297  0.01  [C0402-Phillips]
C298  10uF  [CA3216]
C299  0.1  [C0402-Phillips]
C300  0.1  [C0402-Phillips]
L46  TI160808U601  [Ti160808-Phillips]
LED1  L7104SA/3GD  [L-7104SA/3]  (value not drawn)  (parts A,B,C of 3)
LED1A'  APA-1606CGCK  [KPA-1606g]
LED1B'  APA-1606CGCK  [KPA-1606g]
LED1C'  APA-1606CGCK  [KPA-1606g]
LED2  L7104SA/3GD  [L-7104SA/3]  (value not drawn)  (parts A,B,C of 3)
LED2A'  APA-1606CGCK  [KPA-1606g]
LED2B'  APA-1606CGCK  [KPA-1606g]
LED2C'  APA-1606CGCK  [KPA-1606g]
LED3  L7104SA/3GD  [L-7104SA/3]  (part C of 3)
LED3C'  APA-1606CGCK  [KPA-1606g]
LED4  LS Q976-NR-1  [LED-0603y]
Q1  FDV301N  [SOT23-Philips]
Q2  FDV301N  [SOT23-Philips]
R14  10  [R0603-PHILLIPS]
R15  10  [R0603-PHILLIPS]
R16  10  [R0603-PHILLIPS]
R17  10  [R0603-PHILLIPS]
R18  10k  [R0603-PHILLIPS]
R19  10k  [R0603-PHILLIPS]
R20  10k  [R0603-PHILLIPS]
R21  10k  [R0603-PHILLIPS]
R22  4k7  [R0603-PHILLIPS]
R23  4k7  [R0603-PHILLIPS]
R24  4k7  [R0603-PHILLIPS]
R26  1k  [R0603-PHILLIPS]
R27  1k  [R0603-PHILLIPS]
R28  330  [R0603-PHILLIPS]
R29  1k  [R0603-PHILLIPS]
R30  4k7  [R0603-PHILLIPS]
R31  330  [R0603-PHILLIPS]
R32  330  [R0603-PHILLIPS]
R33  1k  [R0603-PHILLIPS]
R34  1k  [R0603-PHILLIPS]
R35  1k  [R0603-PHILLIPS]
R36  1k  [R0603-PHILLIPS]
R37  1k  [R0603-PHILLIPS]
R38  1k  [R0603-PHILLIPS]
R67  1k5  [R0603-PHILLIPS]
R79  330  [R0603-PHILLIPS]
R81  330  [R0603-PHILLIPS]
R82  330  [R0603-PHILLIPS]
R83  330  [R0603-PHILLIPS]
R84  330  [R0603-PHILLIPS]
R85  330  [R0603-PHILLIPS]
R86  330  [R0603-PHILLIPS]
R87  330  [R0603-PHILLIPS]
R88  330  [R0603-PHILLIPS]
R94  1k  [R0603-PHILLIPS]
R149  330  [R0603-PHILLIPS]
R152  2k4  [R0603-PHILLIPS]
R162  1K  [R0603-PHILLIPS]
R163  1k  [R0603-PHILLIPS]
R164  1k  [R0603-PHILLIPS]
R165  0  [R0603-PHILLIPS]
R166  0  [R0603-PHILLIPS]
S1  Misc: "RESET"  [TL3340]  (hidden comment: TL3340AF160QG)
S2  Misc: "SAFE"  [TL3340]  (hidden comment: TL3340AF160QG)
U6  S25FL064K0SMFI01  [SO-8[wide200]]
U6A  M25P64-VMF6  [so-16W]
U7  24LC024SN  Address: 1010000  [SOIC8]
U8  XC6SLX75-2FGG484C  [FBGA484]  (parts C,E of 8)
U33  FT232RL  [SSOP-28(5.3X10/0.65)]
X1  SBH21-NBPN-D07-SM-BK  Other: JTAG  [SBH-14]  (parts A,B,C,D,E,F,G,H,I,J,K,L,M,N of 14)
X3  USB B-M5-SMD  [USB/SM0.8-6H5]
X16  SBH21-NBPN-D08-SM-BK  Misc: EXT PANEL  [SBH-16]  (parts A,B,C,D,E,F,G,H,I,J,K,L,M,N,O,P of 16)

### Ports
1PPS_SW, 26MHZ_SW, AUX_LD1, AUX_LD2, AUX_SCLK, AUX_SDAT, AUX_SEN1, AUX_SEN2, AUX_SEN3, AUX_SEN4, AUX_XX, DAC_CLK (in), DAC_DIN (in), DAC_NSY (in), ETH_LEDG, ETH_LEDO, FAN_ON (in), GPS_STBY (out), LED_CLK, LED_GPS, OVERHEAT (in), PPS_IN (in), RXD2 (in), SCL, SDA, TXD2 (out)

### Nets
+2,5VCC: X16.14
+3,3VFPGA: C25.1 C27.2 LED1.4(A3) LED1.5(A2) LED1.6(A1) LED1A'.2(A) LED1B'.2(A) LED1C'.2(A) LED2.4(A3) LED2.5(A2) LED2.6(A1) LED2A'.2(A) LED2B'.2(A) LED2C'.2(A) LED3.4(A3) LED3C'.2(A) R18.1 R19.1 R21.1 R22.1 R26.1 R27.1 R28.1 R29.1 R30.1 R31.2 R94.1 R152.1 U6.3(~{WP}) U6.7(~{HOLD}) U6.8(Vcc) U6A.1(~{HOLD}) U6A.2(Vcc) U6A.9(~{WP}) U7.8(VCC) X1.2 X16.16
GND: C25.2 C26.2 C27.1 C43.1 C297.1 C298.2(-) C299.2 C300.2 Q1.2(S) Q2.2(S) R20.2 R23.1 R24.1 R32.2 R67.1 S1.2 S1.3 S1.4 S2.2 S2.3 S2.4 U6.4(GND) U6A.10(GND) U7.1(A0) U7.2(A1) U7.3(A2) U7.4(VSS) U7.7(WP) U33.7(GND) U33.18(GND) U33.21(GND) U33.25(AGND) U33.26(TEST) X1.1 X1.3 X1.5 X1.7 X1.9 X1.11 X1.13 X3.0(GND) X3.4(GND) X16.15
1PPS_SW: X16.12 ; port 1PPS_SW
26MHZ_SW: X16.13 ; port 26MHZ_SW
AUX_LD1: U8.AB6(IO_L49N_D4_2) ; port AUX_LD1
AUX_LD2: U8.AB9(IO_L43N_2) ; port AUX_LD2
AUX_SCLK: U8.AB12(IO_L31N_GCLK30_D15_2) ; port AUX_SCLK
AUX_SDAT: U8.AB8(IO_L45N_2) ; port AUX_SDAT
AUX_SEN1: U8.AA8(IO_L45P_2) ; port AUX_SEN1
AUX_SEN2: U8.AB11(IO_L32N_GCLK28_2) ; port AUX_SEN2
AUX_SEN3: U8.AB7(IO_L48N_RDWR_B_VREF_2) ; port AUX_SEN3
AUX_SEN4: U8.AB10(IO_L41N_VREF_2) ; port AUX_SEN4
AUX_XX: U8.AA6(IO_L49P_D3_2) ; port AUX_XX
DAC_CLK: U8.AB19(IO_L5N_2) ; port DAC_CLK
DAC_DIN: U8.AA18(IO_L14P_D11_2) ; port DAC_DIN
DAC_NSY: U8.Y19(IO_L5P_2) ; port DAC_NSY
DONE: Q1.1(G) R28.2 U8.Y22(DONE_2)
ETH_LEDG: U8.Y15(IO_L21P_2) ; port ETH_LEDG
ETH_LEDO: U8.W12(IO_L29P_GCLK3_2) ; port ETH_LEDO
FAN_ON: U8.AB14(IO_L16N_VREF_2) ; port FAN_ON
FLASH_CLK: U6.6(SCK) U6A.16(SCK) U8.Y21(IO_L1P_CCLK_2)
FLASH_CS: R152.2 U6.1(~{CS}) U6A.7(~{CS}) U8.T5(IO_L65N_CSO_B_2)
FLASH_MISO: R149.1 U8.AA20(IO_L3P_D0_DIN_MISO_MISO1_2)
FLASH_MOSI: U6.5(SI) U6A.15(SI) U8.AB20(IO_L3N_MOSI_CSI_B_MISO0_2)
FPGA_PRG_B: C26.1 R22.2 S1.1 U8.AA1(PROGRAM_B_2) X16.11
FPGA_SAFE: C43.2 R94.2 S2.1 U8.AB4(IO_L57N_2) X16.10
GPS_STBY: U8.AA4(IO_L57P_2) ; port GPS_STBY
INIT_B: Q2.1(G) R30.2 U8.T6(IO_L65P_INIT_B_2)
LED_CLK: R79.2 ; port LED_CLK
LED_DONE: Q1.3(D) R33.2 R81.2
LED_GPS: R88.2 ; port LED_GPS
LED_STATUS: R87.2 R162.1 U8.AB3(IO_L58N_2)
LEDS1: R34.2 R82.2 U8.Y3(IO_L58P_2)
LEDS2: R35.2 R83.2 U8.W4(IO_L62P_D5_2)
LEDS3: R36.2 R84.2 U8.AB2(IO_L64N_D9_2)
LEDS4: R37.2 R85.2 U8.Y4(IO_L62N_D6_2)
LEDS5: R38.2 R86.2 U8.AA2(IO_L64P_D8_2)
M0: R31.1 U8.AA22(IO_L1N_M0_CMPMISO_2)
M1: R32.1 U8.U15(IO_L13P_M1_2)
OVERHEAT: U8.AB13(IO_L30N_GCLK0_USERCCLK_2) ; port OVERHEAT
PPS_IN: U8.AB18(IO_L14N_D12_2) ; port PPS_IN
RXD1: R163.1 U8.T17(IO_L4N_VREF_2)
RXD2: U8.AB17(IO_L15N_2) ; port RXD2
SCL: R26.2 U7.6(SCL) U8.AA14(IO_L16P_2) ; port SCL
SDA: R27.2 U7.5(SDA) U8.AA16(IO_L19P_2) ; port SDA
TCK: R15.1 X1.6
TDI: R17.1 X1.10
TDO: R16.1 X1.8
TMS: R14.1 X1.4
TXD1: R164.1 U8.T18(IO_L4P_2)
TXD2: U8.Y17(IO_L15P_2) ; port TXD2
NetC297_2: C297.2 L46.1 X3.1(V_BUS)
NetC298_1: C298.1(+) C299.1 L46.2 U33.20(VCC)
NetC300_1: C300.1 U33.4(VCCIO) U33.17(3V3OUT)
NetLED1_1: LED1.1(K1) LED1A'.1(K) R33.1
NetLED1_2: LED1.2(K2) LED1B'.1(K) R34.1
NetLED1_3: LED1.3(K3) LED1C'.1(K) R35.1
NetLED2_1: LED2.1(K1) LED2A'.1(K) R36.1
NetLED2_2: LED2.2(K2) LED2B'.1(K) R37.1
NetLED2_3: LED2.3(K3) LED2C'.1(K) R38.1
NetLED3_3: LED3.3(K3) LED3C'.1(K) R162.2
NetLED4_1: LED4.1(K) Q2.3(D)
NetLED4_2: LED4.2(A) R29.2
NetR14_2: R14.2 R18.2 U8.C18(TMS)
NetR15_2: R15.2 R20.1 U8.G15(TCK)
NetR16_2: R16.2 U8.A19(TDO)
NetR17_2: R17.2 R19.2 U8.E18(TDI)
NetR21_2: R21.2 U8.P16(VFS)
NetR23_2: R23.2 U8.N15(SUSPEND)
NetR24_2: R24.2 R67.2 U8.P15(RFUSE)
NetR79_1: R79.1 X16.9
NetR81_1: R81.1 X16.1
NetR82_1: R82.1 X16.2
NetR83_1: R83.1 X16.3
NetR84_1: R84.1 X16.4
NetR85_1: R85.1 X16.5
NetR86_1: R86.1 X16.6
NetR87_1: R87.1 X16.7
NetR88_1: R88.1 X16.8
NetR149_2: R149.2 U6.2(SO) U6A.8(SO)
NetR163_2: R163.2 U33.1(TXD)
NetR164_2: R164.2 U33.5(RXD)
NetR165_1: R165.1 U33.2(~{DTR})
NetR165_2: R165.2 U33.9(~{DSR})
NetR166_1: R166.1 U33.3(~{RTS})
NetR166_2: R166.2 U33.11(~{CTS})
NetU33_15: U33.15(USBDP) X3.3(D+)
NetU33_16: U33.16(USBDM) X3.2(D–)

Not connected (* = marked no-connect by the designer): U8 AA10(IO_L41P_2)* AA12(IO_L31P_GCLK31_D14_2)* AA21(IO_L2P_CMPCLK_2)* AB15(IO_L21N_2)* AB16(IO_L19N_2)* AB21(IO_L2N_CMPMOSI_2)* U13(IO_L12N_D2_MISO3_2)* U14(IO_L12P_D1_MISO2_2)* V11(IO_L42P_2)* V15(IO_L13N_D10_2)* W11(IO_L42N_2)* Y7(IO_L48P_D7_2)* Y9(IO_L43P_2)* Y11(IO_L32P_GCLK29_2)* Y12(IO_L29N_GCLK2_2)* Y13(IO_L30P_GCLK1_D13_2)* Y20(CMPCS_B_2)*; U33 6(~{RI})* 8(NC)* 10(~{DCD})* 12(CBUS4)* 13(CBUS2)* 14(CBUS3)* 19(~{RESET})* 22(CBUS1)* 23(CBUS0)* 24(NC)* 27(OSCI)* 28(OSCO)*; X1 12* 14*

### Notes on the sheet
- F (Done)
- D (FW loaded)
- B (Cable link)
- E (REF lock)
- C (RXing)
- A (TXing)
- H (Status)
- (in symbol CA3216) A
- (in symbol XC6SLX75-2FGG484C, part C) BANK 2

### Library data of the parts
C25-C27 C43 C297 C299 C300 = C0402: as C113 on sheet PwrAndBias
  C25-C27 C43 C299 C300: Value: 0.1
  C297: Value: 0.01
C298 = CA3216: Конденсатор; Manufacturer: SPRAGUE; Name: Case A; U/P/TKE: 10V; Value: 10uF
L46 = TI160808: Дроссель ЭМС; Manufacturer: MURATA; Name: TI160808U601; Value: *
LED1-LED3 = L7104SA/3: Светодиод; Manufacturer: KINGBRIGTH; PDF: d:\Proj\Components\Kingbright\L-7104SA-3GD(Ver.4).pdf; Name: L7104SA/3GD
LED1A' LED1B' LED1C' LED2A' LED2B' LED2C' LED3C' = KPA-1606: Светодиод; Manufacturer: Kingbright; Name: APA-1606CGCK
LED4 = LED0603: LED SMD; Manufacturer: OSRAM Opto Semiconductors Inc; Name: LS Q976-NR-1
Q1 Q2 = FDV301N: Транзистор; Manufacturer: Fairchild; PDF: D:\Proj\Components\FairChild\FDV301N.pdf; Name: FDV301N
R14-R24 R26-R38 R67 R79 R81-R88 R94 R149 R152 R162-R166 = R0603: as R128 on sheet PwrAndBias
  R14-R17: Value: 10
  R18-R21: Value: 10k
  R22-R24 R30: Value: 4k7
  R26 R27 R29 R33-R38 R94 R163 R164: Value: 1k
  R28 R31 R32 R79 R81-R88 R149: Value: 330
  R67: Value: 1k5
  R152: Value: 2k4
  R162: Value: 1K
  R165 R166: Value: 0
S1 S2 = TL3340AF160QG: Switch Tactile SMD right angle; Manufacturer: E-Switch; Name: TL3340AF160QG
U6 = S25FL064K: Микросхема; Manufacturer: SPANSION; Swap: No; Name: S25FL064K0SMFI01
U6A = M25P64-VMF6: Микросхема; Manufacturer: ST; Swap: No; Name: M25P64-VMF6
U7 = AT24CXX: Микросхема; Manufacturer: Microchip; Swap: No; PDF: d:\Proj\components\Atmel\AT24C02A_04A_08A_16A.pdf; PDF2: d:\Proj\Components\Atmel\AT24C04B_08B.pdf; Name: 24LC024SN; Supplier 1: Digi-Key
U8 = XC6SLX75-2FGG484C: as U8 on sheet PwrAndBias; Published: 1-Jul-2010; Supplier 1: Digi-Key; Supplier Part Number 1: XC6SLX75-2FGG484C-ND; ComponentLink1Description: Manufacturer Link; ComponentLink1URL: http://www.xilinx.com; ComponentLink2Description: Spartan-6 Datasheet; ComponentLink2URL: http://www.xilinx.com/support/documentation/data_sheets/ds160.pdf; ComponentLink3Description: Spartan-6 Documents; ComponentLink3URL: http://www.xilinx.com/support/documentation/spartan-6.htm; ComponentLink4Description: Xilinx.com Home; ComponentLink4URL: http://www.xilinx.com; Misc: Spartan-6 LX 1.2V FPGA; Name: XC6SLX75-2FGG484C
U33 = FT232RL: Микросхема; Manufacturer: FTDI; Misc: USB UART Asynchronous Serial Data Transfer Chip,; Name: FT232RL; ComponentLink1Description: Manufacturer Link; ComponentLink1URL: http://www.ftdichip.com/Products/ICs/FT232R.htm; ComponentLink2Description: Datasheet; ComponentLink2URL: http://www.ftdichip.com/Support/Documents/DataSheets/ICs/DS_FT232R.pdf
X1 = SBH21-7x2_SMD: Разъем; Manufacturer: Sullins; Name: SBH21-NBPN-D07-SM-BK
X3 = USB M-1J: Разъём; Name: USB B-M5-SMD
X16 = SBH21-8x2_SMD: Connector 2mm SMD; Manufacturer: Sullins; Name: SBH21-NBPN-D08-SM-BK